# EAGLE design rPi_vsynth (EAGLE 8.5.0)
Hybrid Video Synth
DESIGNNAME: Hybrid Video Synth

## Sheet 1 of 4: Raspberry Pi
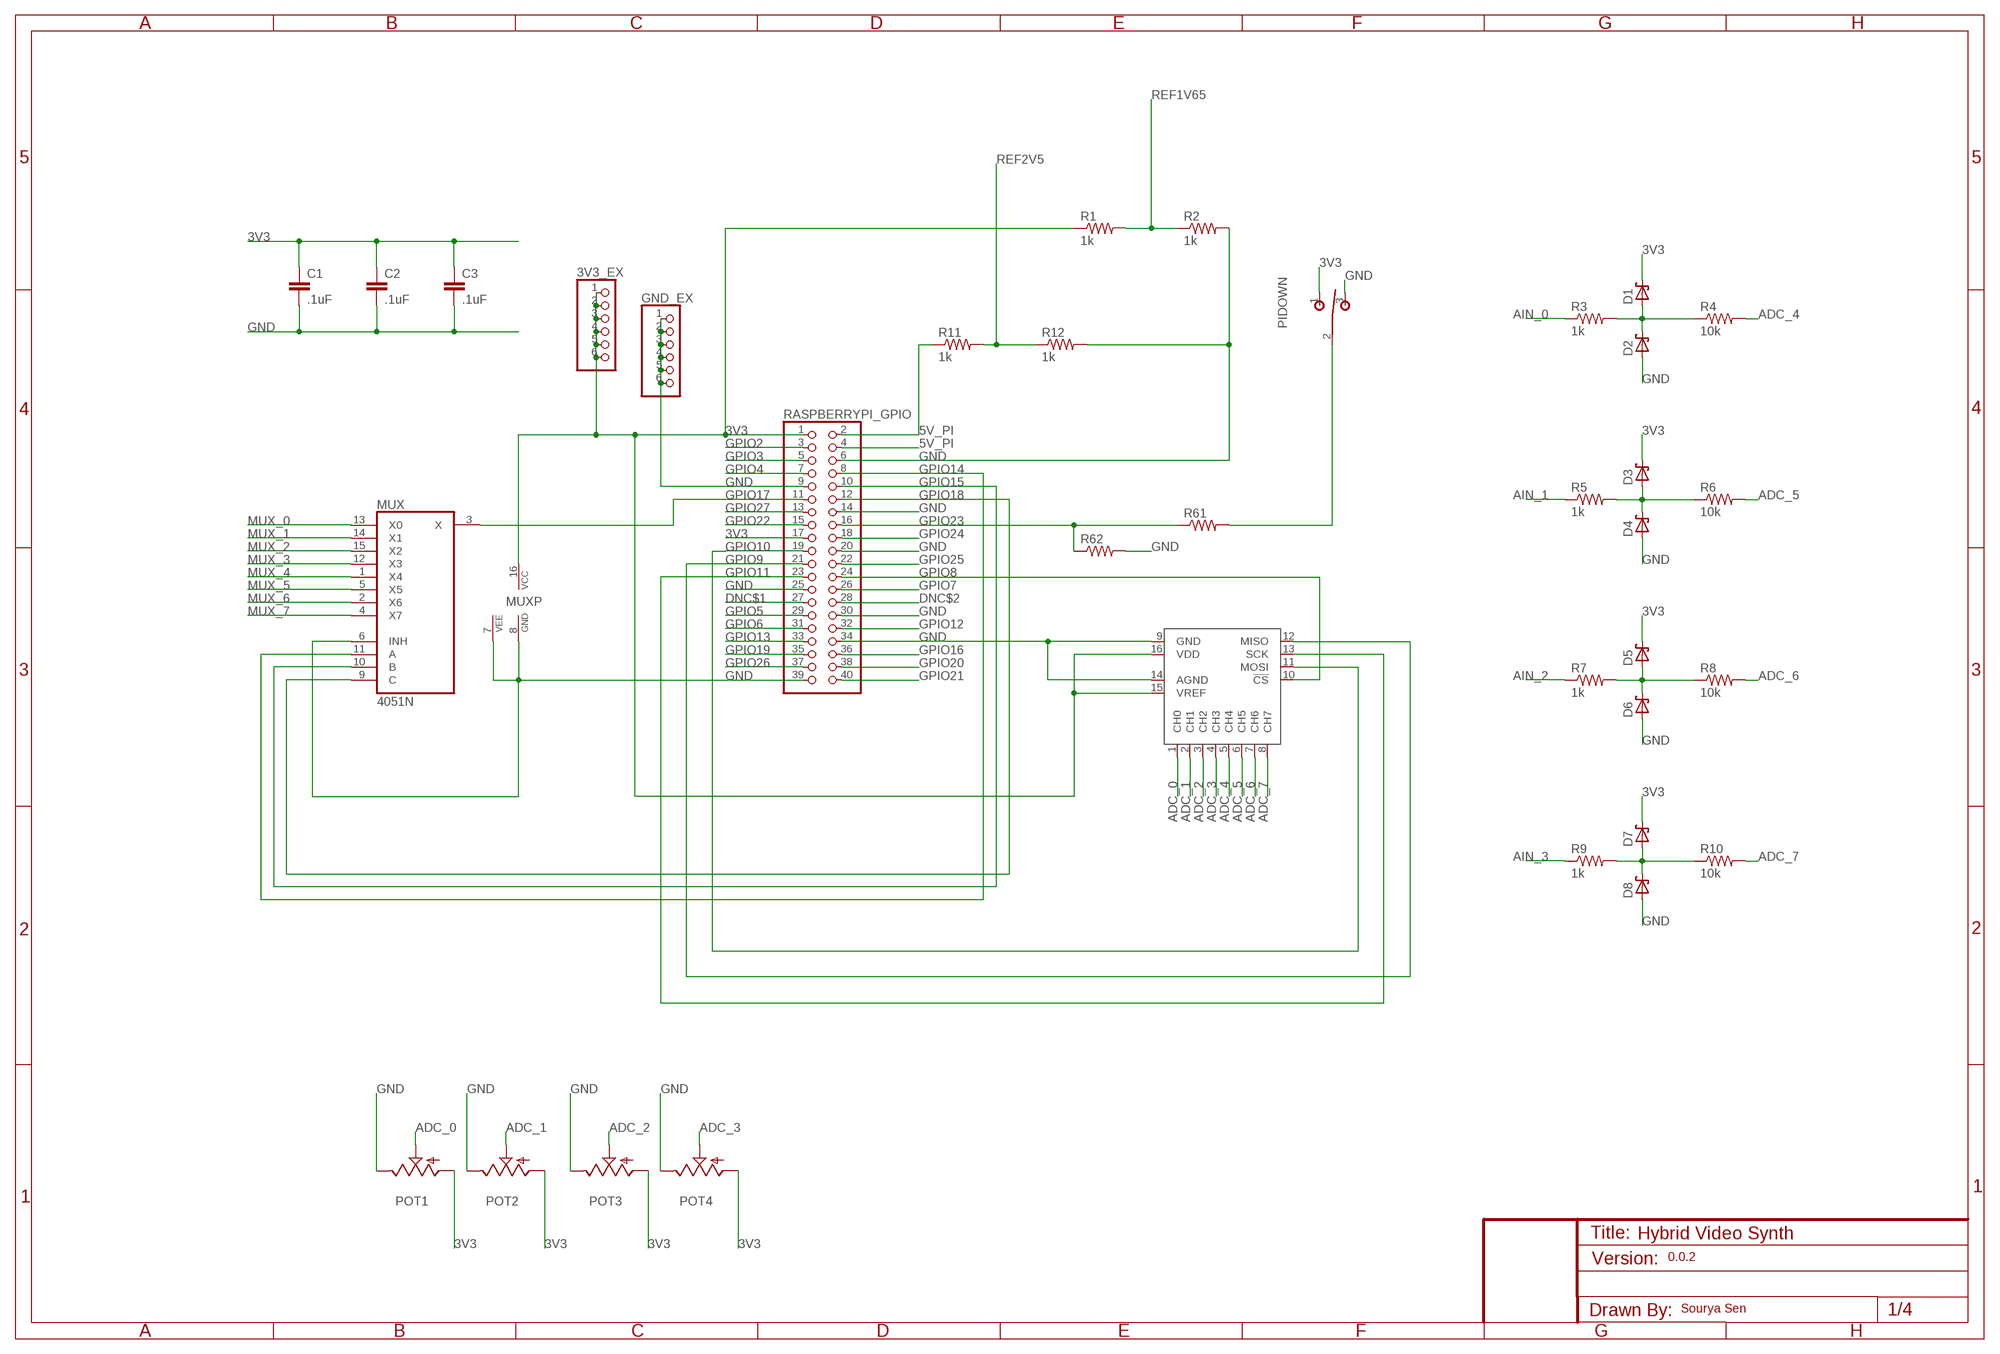
[diagram p0: schematic, sheet 1]

### Parts
3V3_EX  PINHD-1X6B  [1X06-BIG]
C1  .1uF  CAPPTH2  [CAP-PTH-SMALL2]
C2  .1uF  CAPPTH2  [CAP-PTH-SMALL2]
C3  .1uF  CAPPTH2  [CAP-PTH-SMALL2]
D1  SCHOTTKY-DIODEDO35-7  [DO35-7]
D2  SCHOTTKY-DIODEDO35-7  [DO35-7]
D3  SCHOTTKY-DIODEDO35-7  [DO35-7]
D4  SCHOTTKY-DIODEDO35-7  [DO35-7]
D5  SCHOTTKY-DIODEDO35-7  [DO35-7]
D6  SCHOTTKY-DIODEDO35-7  [DO35-7]
D7  SCHOTTKY-DIODEDO35-7  [DO35-7]
D8  SCHOTTKY-DIODEDO35-7  [DO35-7]
GND_EX  PINHD-1X6B  [1X06-BIG]
MCP3008  MCP3008P  [DIL16]
MUX  4051N  [DIL16]
PIDOWN  T-80-T-SPDT-ON-OFF-ON  [M9040P]
POT1  9MM_SNAP-IN_POT_  [9MM_SNAP-IN_POT]
POT2  9MM_SNAP-IN_POT_  [9MM_SNAP-IN_POT]
POT3  9MM_SNAP-IN_POT_  [9MM_SNAP-IN_POT]
POT4  9MM_SNAP-IN_POT_  [9MM_SNAP-IN_POT]
R1  1k  RESISTORPTH-1/4W  [AXIAL-0.4]
R2  1k  RESISTORPTH-1/4W  [AXIAL-0.4]
R3  1k  RESISTORPTH-1/4W  [AXIAL-0.4]
R4  10k  RESISTORPTH-1/4W  [AXIAL-0.4]
R5  1k  RESISTORPTH-1/4W  [AXIAL-0.4]
R6  10k  RESISTORPTH-1/4W  [AXIAL-0.4]
R7  1k  RESISTORPTH-1/4W  [AXIAL-0.4]
R8  10k  RESISTORPTH-1/4W  [AXIAL-0.4]
R9  1k  RESISTORPTH-1/4W  [AXIAL-0.4]
R10  10k  RESISTORPTH-1/4W  [AXIAL-0.4]
R11  1k  RESISTORPTH-1/4W  [AXIAL-0.4]
R12  1k  RESISTORPTH-1/4W  [AXIAL-0.4]
R61  RESISTORPTH-1/4W  [AXIAL-0.4]
R62  RESISTORPTH-1/4W  [AXIAL-0.4]
RASPBERRYPI_GPIO  PINHD-2X20  [2X20]

### Nets
3V3 [POWER]: 3V3_EX.1 3V3_EX.2 3V3_EX.3 3V3_EX.4 3V3_EX.5 3V3_EX.6 C1.1 C2.1 C3.1 D1.C D3.C D5.C D7.C MCP3008.15(VREF) MCP3008.16(VDD) MUX.16(VCC) PIDOWN.1(O) POT1.1(A) POT2.1(A) POT3.1(A) POT4.1(A) R1.P$1 RASPBERRYPI_GPIO.1 RASPBERRYPI_GPIO.17 ; also sheet 3
5V_PI [POWER]: R11.P$1 RASPBERRYPI_GPIO.2 RASPBERRYPI_GPIO.4 ; also sheet 2
ADC_0: MCP3008.1(CH0) POT1.2(S)
ADC_1: MCP3008.2(CH1) POT2.2(S)
ADC_2: MCP3008.3(CH2) POT3.2(S)
ADC_3: MCP3008.4(CH3) POT4.2(S)
ADC_4: MCP3008.5(CH4) R4.P$2
ADC_5: MCP3008.6(CH5) R6.P$2
ADC_6: MCP3008.7(CH6) R8.P$2
ADC_7: MCP3008.8(CH7) R10.P$2
AIN_0: R3.P$1 ; also sheet 2
AIN_1: R5.P$1 ; also sheet 2
AIN_2: R7.P$1 ; also sheet 2
AIN_3: R9.P$1 ; also sheet 2
DNC$1: RASPBERRYPI_GPIO.27
DNC$2: RASPBERRYPI_GPIO.28
GND [GND]: C1.2 C2.2 C3.2 D2.A D4.A D6.A D8.A GND_EX.1 GND_EX.2 GND_EX.3 GND_EX.4 GND_EX.5 GND_EX.6 MCP3008.9(GND) MCP3008.14(AGND) MUX.6(INH) MUX.7(VEE) MUX.8(GND) PIDOWN.3(S) POT1.3(E) POT2.3(E) POT3.3(E) POT4.3(E) R2.P$2 R12.P$2 R62.P$2 RASPBERRYPI_GPIO.6 RASPBERRYPI_GPIO.9 RASPBERRYPI_GPIO.14 RASPBERRYPI_GPIO.20 RASPBERRYPI_GPIO.25 RASPBERRYPI_GPIO.30 RASPBERRYPI_GPIO.34 RASPBERRYPI_GPIO.39 ; also sheet 2,3,4
GPIO2: RASPBERRYPI_GPIO.3
GPIO3: RASPBERRYPI_GPIO.5
GPIO4: RASPBERRYPI_GPIO.7
GPIO5: RASPBERRYPI_GPIO.29
GPIO6: RASPBERRYPI_GPIO.31
GPIO7: RASPBERRYPI_GPIO.26
GPIO8: MCP3008.10(!CS) RASPBERRYPI_GPIO.24
GPIO9: MCP3008.12(MISO) RASPBERRYPI_GPIO.21
GPIO10: MCP3008.11(MOSI) RASPBERRYPI_GPIO.19
GPIO11: MCP3008.13(SCK) RASPBERRYPI_GPIO.23
GPIO12: RASPBERRYPI_GPIO.32
GPIO13: RASPBERRYPI_GPIO.33
GPIO14: MUX.11(A) RASPBERRYPI_GPIO.8
GPIO15: MUX.10(B) RASPBERRYPI_GPIO.10
GPIO16: RASPBERRYPI_GPIO.36
GPIO17: MUX.3(X) RASPBERRYPI_GPIO.11
GPIO18: MUX.9(C) RASPBERRYPI_GPIO.12
GPIO19: RASPBERRYPI_GPIO.35
GPIO20: RASPBERRYPI_GPIO.38
GPIO21: RASPBERRYPI_GPIO.40
GPIO22: RASPBERRYPI_GPIO.15
GPIO23: R61.P$1 R62.P$1 RASPBERRYPI_GPIO.16
GPIO24: RASPBERRYPI_GPIO.18
GPIO25: RASPBERRYPI_GPIO.22
GPIO26: RASPBERRYPI_GPIO.37
GPIO27: RASPBERRYPI_GPIO.13
MUX_0: MUX.13(X0) ; also sheet 3,4
MUX_1: MUX.14(X1) ; also sheet 3,4
MUX_2: MUX.15(X2) ; also sheet 3,4
MUX_3: MUX.12(X3) ; also sheet 3,4
MUX_4: MUX.1(X4) ; also sheet 3,4
MUX_5: MUX.5(X5) ; also sheet 3,4
MUX_6: MUX.2(X6) ; also sheet 3,4
MUX_7: MUX.4(X7) ; also sheet 3,4
N$1: D1.A D2.C R3.P$2 R4.P$1
N$2: D3.A D4.C R5.P$2 R6.P$1
N$3: D5.A D6.C R7.P$2 R8.P$1
N$4: D7.A D8.C R9.P$2 R10.P$1
N$63: PIDOWN.2(P) R61.P$2
REF1V65 [POWER]: R1.P$2 R2.P$1 ; also sheet 2
REF2V5 [POWER]: R11.P$2 R12.P$1 ; also sheet 2

## Sheet 2 of 4: Opamps and Euro Power
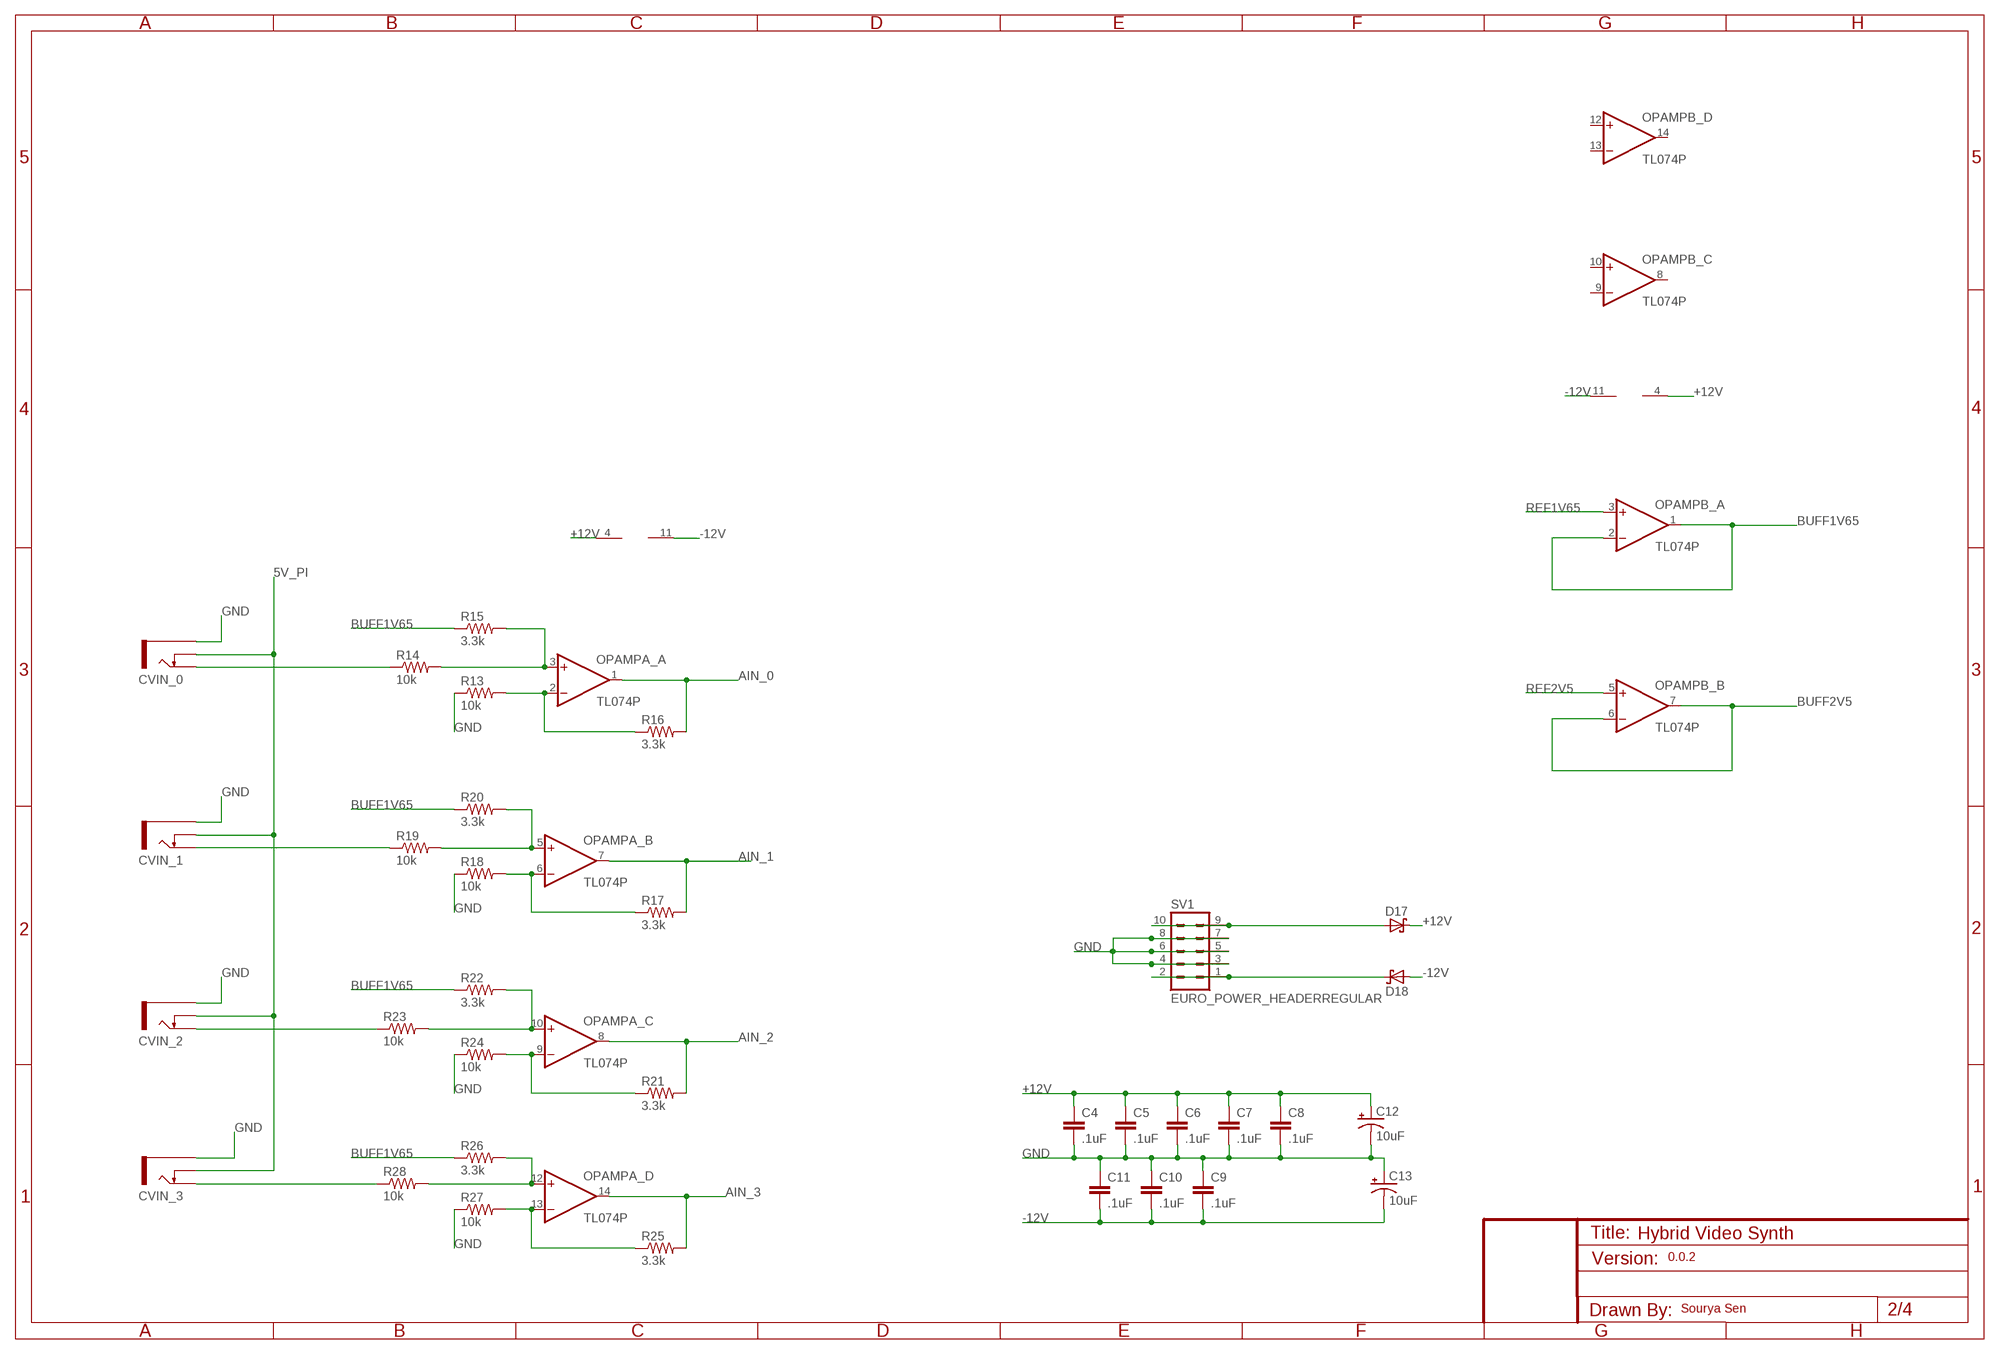
[diagram p1: schematic, sheet 2]

### Parts
C4  .1uF  CAPPTH2  [CAP-PTH-SMALL2]
C5  .1uF  CAPPTH2  [CAP-PTH-SMALL2]
C6  .1uF  CAPPTH2  [CAP-PTH-SMALL2]
C7  .1uF  CAPPTH2  [CAP-PTH-SMALL2]
C8  .1uF  CAPPTH2  [CAP-PTH-SMALL2]
C9  .1uF  CAPPTH2  [CAP-PTH-SMALL2]
C10  .1uF  CAPPTH2  [CAP-PTH-SMALL2]
C11  .1uF  CAPPTH2  [CAP-PTH-SMALL2]
C12  10uF  CAP_POLPTH2  [CPOL-RADIAL-10UF-25V]
C13  10uF  CAP_POLPTH2  [CPOL-RADIAL-10UF-25V]
CVIN_0  THONKICONNOLD  [THONKICONN]
CVIN_1  THONKICONNOLD  [THONKICONN]
CVIN_2  THONKICONNOLD  [THONKICONN]
CVIN_3  THONKICONNOLD  [THONKICONN]
D17  SCHOTTKY-DIODEDO35-7  [DO35-7]
D18  SCHOTTKY-DIODEDO35-7  [DO35-7]
OPAMPA_  TL074P  [DIL14]
OPAMPB_  TL074P  [DIL14]
R13  10k  RESISTORPTH-1/4W  [AXIAL-0.4]
R14  10k  RESISTORPTH-1/4W  [AXIAL-0.4]
R15  3.3k  RESISTORPTH-1/4W  [AXIAL-0.4]
R16  3.3k  RESISTORPTH-1/4W  [AXIAL-0.4]
R17  3.3k  RESISTORPTH-1/4W  [AXIAL-0.4]
R18  10k  RESISTORPTH-1/4W  [AXIAL-0.4]
R19  10k  RESISTORPTH-1/4W  [AXIAL-0.4]
R20  3.3k  RESISTORPTH-1/4W  [AXIAL-0.4]
R21  3.3k  RESISTORPTH-1/4W  [AXIAL-0.4]
R22  3.3k  RESISTORPTH-1/4W  [AXIAL-0.4]
R23  10k  RESISTORPTH-1/4W  [AXIAL-0.4]
R24  10k  RESISTORPTH-1/4W  [AXIAL-0.4]
R25  3.3k  RESISTORPTH-1/4W  [AXIAL-0.4]
R26  3.3k  RESISTORPTH-1/4W  [AXIAL-0.4]
R27  10k  RESISTORPTH-1/4W  [AXIAL-0.4]
R28  10k  RESISTORPTH-1/4W  [AXIAL-0.4]
SV1  EURO_POWER_HEADERREGULAR  [EURO_POWER_HEADER]

### Nets
5V_PI [POWER]: CVIN_0.P$2_SWITCH(SWITCH) CVIN_1.P$2_SWITCH(SWITCH) CVIN_2.P$2_SWITCH(SWITCH) CVIN_3.P$2_SWITCH(SWITCH) ; also sheet 1
+12V [POWER]: C4.1 C5.1 C6.1 C7.1 C8.1 C12.1(+) D17.C OPAMPA_.4(P:V+) OPAMPB_.4(P:V+) ; also sheet 3,4
-12V [POWER]: C9.2 C10.2 C11.2 C13.2(-) D18.A OPAMPA_.11(P:V-) OPAMPB_.11(P:V-)
AIN_0: OPAMPA_.1(A:OUT) R16.P$2 ; also sheet 1
AIN_1: OPAMPA_.7(B:OUT) R17.P$2 ; also sheet 1
AIN_2: OPAMPA_.8(C:OUT) R21.P$2 ; also sheet 1
AIN_3: OPAMPA_.14(D:OUT) R25.P$2 ; also sheet 1
BUFF1V65: OPAMPB_.1(A:OUT) OPAMPB_.2(A:-IN) R15.P$1 R20.P$1 R22.P$1 R26.P$1
BUFF2V5 [POWER]: OPAMPB_.6(B:-IN) OPAMPB_.7(B:OUT) ; also sheet 3
GND [GND]: C4.2 C5.2 C6.2 C7.2 C8.2 C9.1 C10.1 C11.1 C12.2(-) C13.1(+) CVIN_0.P$1_SLEEVE(SLEEVE) CVIN_1.P$1_SLEEVE(SLEEVE) CVIN_2.P$1_SLEEVE(SLEEVE) CVIN_3.P$1_SLEEVE(SLEEVE) R13.P$1 R18.P$1 R24.P$1 R27.P$1 SV1.3 SV1.4 SV1.5 SV1.6 SV1.7 SV1.8 ; also sheet 1,3,4
N$5: OPAMPA_.2(A:-IN) R13.P$2 R16.P$1
N$6: CVIN_0.P$3_TIP(TIP) R14.P$1
N$7: OPAMPA_.6(B:-IN) R17.P$1 R18.P$2
N$8: OPAMPA_.3(A:+IN) R14.P$2 R15.P$2
N$9: OPAMPA_.9(C:-IN) R21.P$1 R24.P$2
N$10: OPAMPA_.5(B:+IN) R19.P$2 R20.P$2
N$11: OPAMPA_.10(C:+IN) R22.P$2 R23.P$2
N$12: CVIN_1.P$3_TIP(TIP) R19.P$1
N$13: OPAMPA_.13(D:-IN) R25.P$1 R27.P$2
N$14: CVIN_2.P$3_TIP(TIP) R23.P$1
N$15: CVIN_3.P$3_TIP(TIP) R28.P$1
N$16: OPAMPA_.12(D:+IN) R26.P$2 R28.P$2
N$66 [POWER]: D17.A SV1.9 SV1.10
N$68 [POWER]: D18.C SV1.1 SV1.2
REF1V65 [POWER]: OPAMPB_.3(A:+IN) ; also sheet 1
REF2V5 [POWER]: OPAMPB_.5(B:+IN) ; also sheet 1
Unconnected: OPAMPB_.8(C:OUT) OPAMPB_.9(C:-IN) OPAMPB_.10(C:+IN) OPAMPB_.12(D:+IN) OPAMPB_.13(D:-IN) OPAMPB_.14(D:OUT)

## Sheet 3 of 4: Trigger Comparators
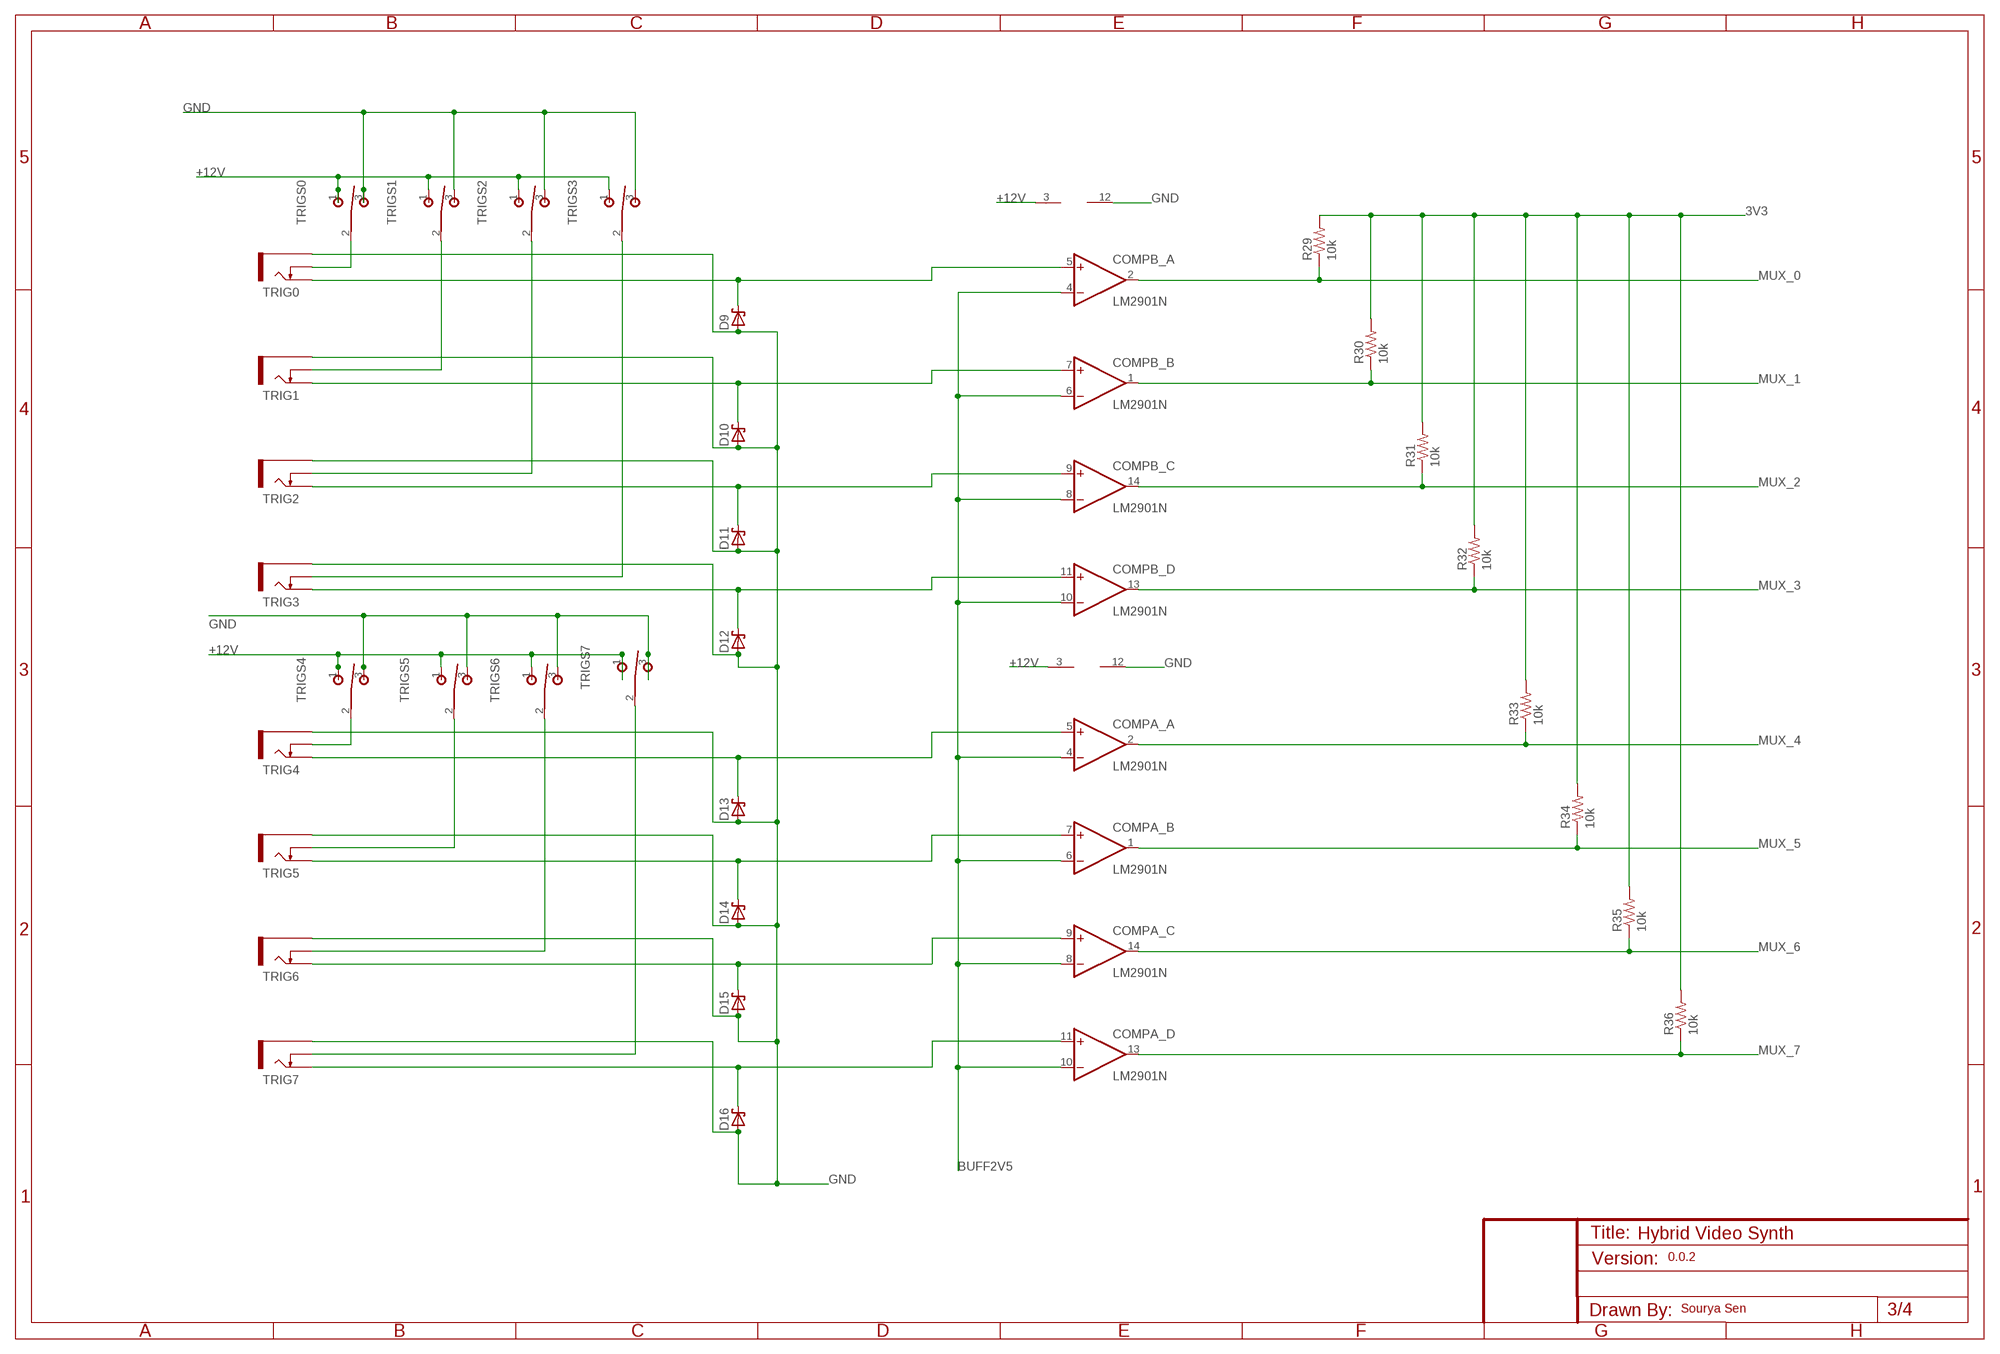
[diagram p2: schematic, sheet 3]

### Parts
COMPA_  LM2901N  [DIL14]
COMPB_  LM2901N  [DIL14]
D9  SCHOTTKY-DIODEDO35-7  [DO35-7]
D10  SCHOTTKY-DIODEDO35-7  [DO35-7]
D11  SCHOTTKY-DIODEDO35-7  [DO35-7]
D12  SCHOTTKY-DIODEDO35-7  [DO35-7]
D13  SCHOTTKY-DIODEDO35-7  [DO35-7]
D14  SCHOTTKY-DIODEDO35-7  [DO35-7]
D15  SCHOTTKY-DIODEDO35-7  [DO35-7]
D16  SCHOTTKY-DIODEDO35-7  [DO35-7]
R29  10k  RESISTORPTH-1/4W  [AXIAL-0.4]
R30  10k  RESISTORPTH-1/4W  [AXIAL-0.4]
R31  10k  RESISTORPTH-1/4W  [AXIAL-0.4]
R32  10k  RESISTORPTH-1/4W  [AXIAL-0.4]
R33  10k  RESISTORPTH-1/4W  [AXIAL-0.4]
R34  10k  RESISTORPTH-1/4W  [AXIAL-0.4]
R35  10k  RESISTORPTH-1/4W  [AXIAL-0.4]
R36  10k  RESISTORPTH-1/4W  [AXIAL-0.4]
TRIG0  THONKICONNOLD  [THONKICONN]
TRIG1  THONKICONNOLD  [THONKICONN]
TRIG2  THONKICONNOLD  [THONKICONN]
TRIG3  THONKICONNOLD  [THONKICONN]
TRIG4  THONKICONNOLD  [THONKICONN]
TRIG5  THONKICONNOLD  [THONKICONN]
TRIG6  THONKICONNOLD  [THONKICONN]
TRIG7  THONKICONNOLD  [THONKICONN]
TRIGS0  T-80-T-SPDT-ON-OFF-ON  [M9040P]
TRIGS1  T-80-T-SPDT-ON-OFF-ON  [M9040P]
TRIGS2  T-80-T-SPDT-ON-OFF-ON  [M9040P]
TRIGS3  T-80-T-SPDT-ON-OFF-ON  [M9040P]
TRIGS4  T-80-T-SPDT-ON-OFF-ON  [M9040P]
TRIGS5  T-80-T-SPDT-ON-OFF-ON  [M9040P]
TRIGS6  T-80-T-SPDT-ON-OFF-ON  [M9040P]
TRIGS7  T-80-T-SPDT-ON-OFF-ON  [M9040P]

### Nets
3V3 [POWER]: R29.P$2 R30.P$2 R31.P$2 R32.P$2 R33.P$2 R34.P$2 R35.P$2 R36.P$2 ; also sheet 1
+12V [POWER]: COMPA_.3(P:V+) COMPB_.3(P:V+) TRIGS0.1(O) TRIGS1.1(O) TRIGS2.1(O) TRIGS3.1(O) TRIGS4.1(O) TRIGS5.1(O) TRIGS6.1(O) TRIGS7.1(O) ; also sheet 2,4
BUFF2V5 [POWER]: COMPA_.4(A:-IN) COMPA_.6(B:-IN) COMPA_.8(C:-IN) COMPA_.10(D:-IN) COMPB_.4(A:-IN) COMPB_.6(B:-IN) COMPB_.8(C:-IN) COMPB_.10(D:-IN) ; also sheet 2
GND [GND]: COMPA_.12(P:V-) COMPB_.12(P:V-) D9.A D10.A D11.A D12.A D13.A D14.A D15.A D16.A TRIG0.P$1_SLEEVE(SLEEVE) TRIG1.P$1_SLEEVE(SLEEVE) TRIG2.P$1_SLEEVE(SLEEVE) TRIG3.P$1_SLEEVE(SLEEVE) TRIG4.P$1_SLEEVE(SLEEVE) TRIG5.P$1_SLEEVE(SLEEVE) TRIG6.P$1_SLEEVE(SLEEVE) TRIG7.P$1_SLEEVE(SLEEVE) TRIGS0.3(S) TRIGS1.3(S) TRIGS2.3(S) TRIGS3.3(S) TRIGS4.3(S) TRIGS5.3(S) TRIGS6.3(S) TRIGS7.3(S) ; also sheet 1,2,4
MUX_0: COMPB_.2(A:OUT) R29.P$1 ; also sheet 1,4
MUX_1: COMPB_.1(B:OUT) R30.P$1 ; also sheet 1,4
MUX_2: COMPB_.14(C:OUT) R31.P$1 ; also sheet 1,4
MUX_3: COMPB_.13(D:OUT) R32.P$1 ; also sheet 1,4
MUX_4: COMPA_.2(A:OUT) R33.P$1 ; also sheet 1,4
MUX_5: COMPA_.1(B:OUT) R34.P$1 ; also sheet 1,4
MUX_6: COMPA_.14(C:OUT) R35.P$1 ; also sheet 1,4
MUX_7: COMPA_.13(D:OUT) R36.P$1 ; also sheet 1,4
N$17: TRIG0.P$2_SWITCH(SWITCH) TRIGS0.2(P)
N$18: TRIG1.P$2_SWITCH(SWITCH) TRIGS1.2(P)
N$19: TRIG2.P$2_SWITCH(SWITCH) TRIGS2.2(P)
N$20: TRIG3.P$2_SWITCH(SWITCH) TRIGS3.2(P)
N$25: TRIG4.P$2_SWITCH(SWITCH) TRIGS4.2(P)
N$26: TRIG5.P$2_SWITCH(SWITCH) TRIGS5.2(P)
N$27: TRIG6.P$2_SWITCH(SWITCH) TRIGS6.2(P)
N$28: TRIG7.P$2_SWITCH(SWITCH) TRIGS7.2(P)
N$50: COMPB_.5(A:+IN) D9.C TRIG0.P$3_TIP(TIP)
N$53: COMPB_.7(B:+IN) D10.C TRIG1.P$3_TIP(TIP)
N$54: COMPB_.9(C:+IN) D11.C TRIG2.P$3_TIP(TIP)
N$56: COMPB_.11(D:+IN) D12.C TRIG3.P$3_TIP(TIP)
N$57: COMPA_.5(A:+IN) D13.C TRIG4.P$3_TIP(TIP)
N$59: COMPA_.7(B:+IN) D14.C TRIG5.P$3_TIP(TIP)
N$60: COMPA_.9(C:+IN) D15.C TRIG6.P$3_TIP(TIP)
N$62: COMPA_.11(D:+IN) D16.C TRIG7.P$3_TIP(TIP)

## Sheet 4 of 4: LED Driver
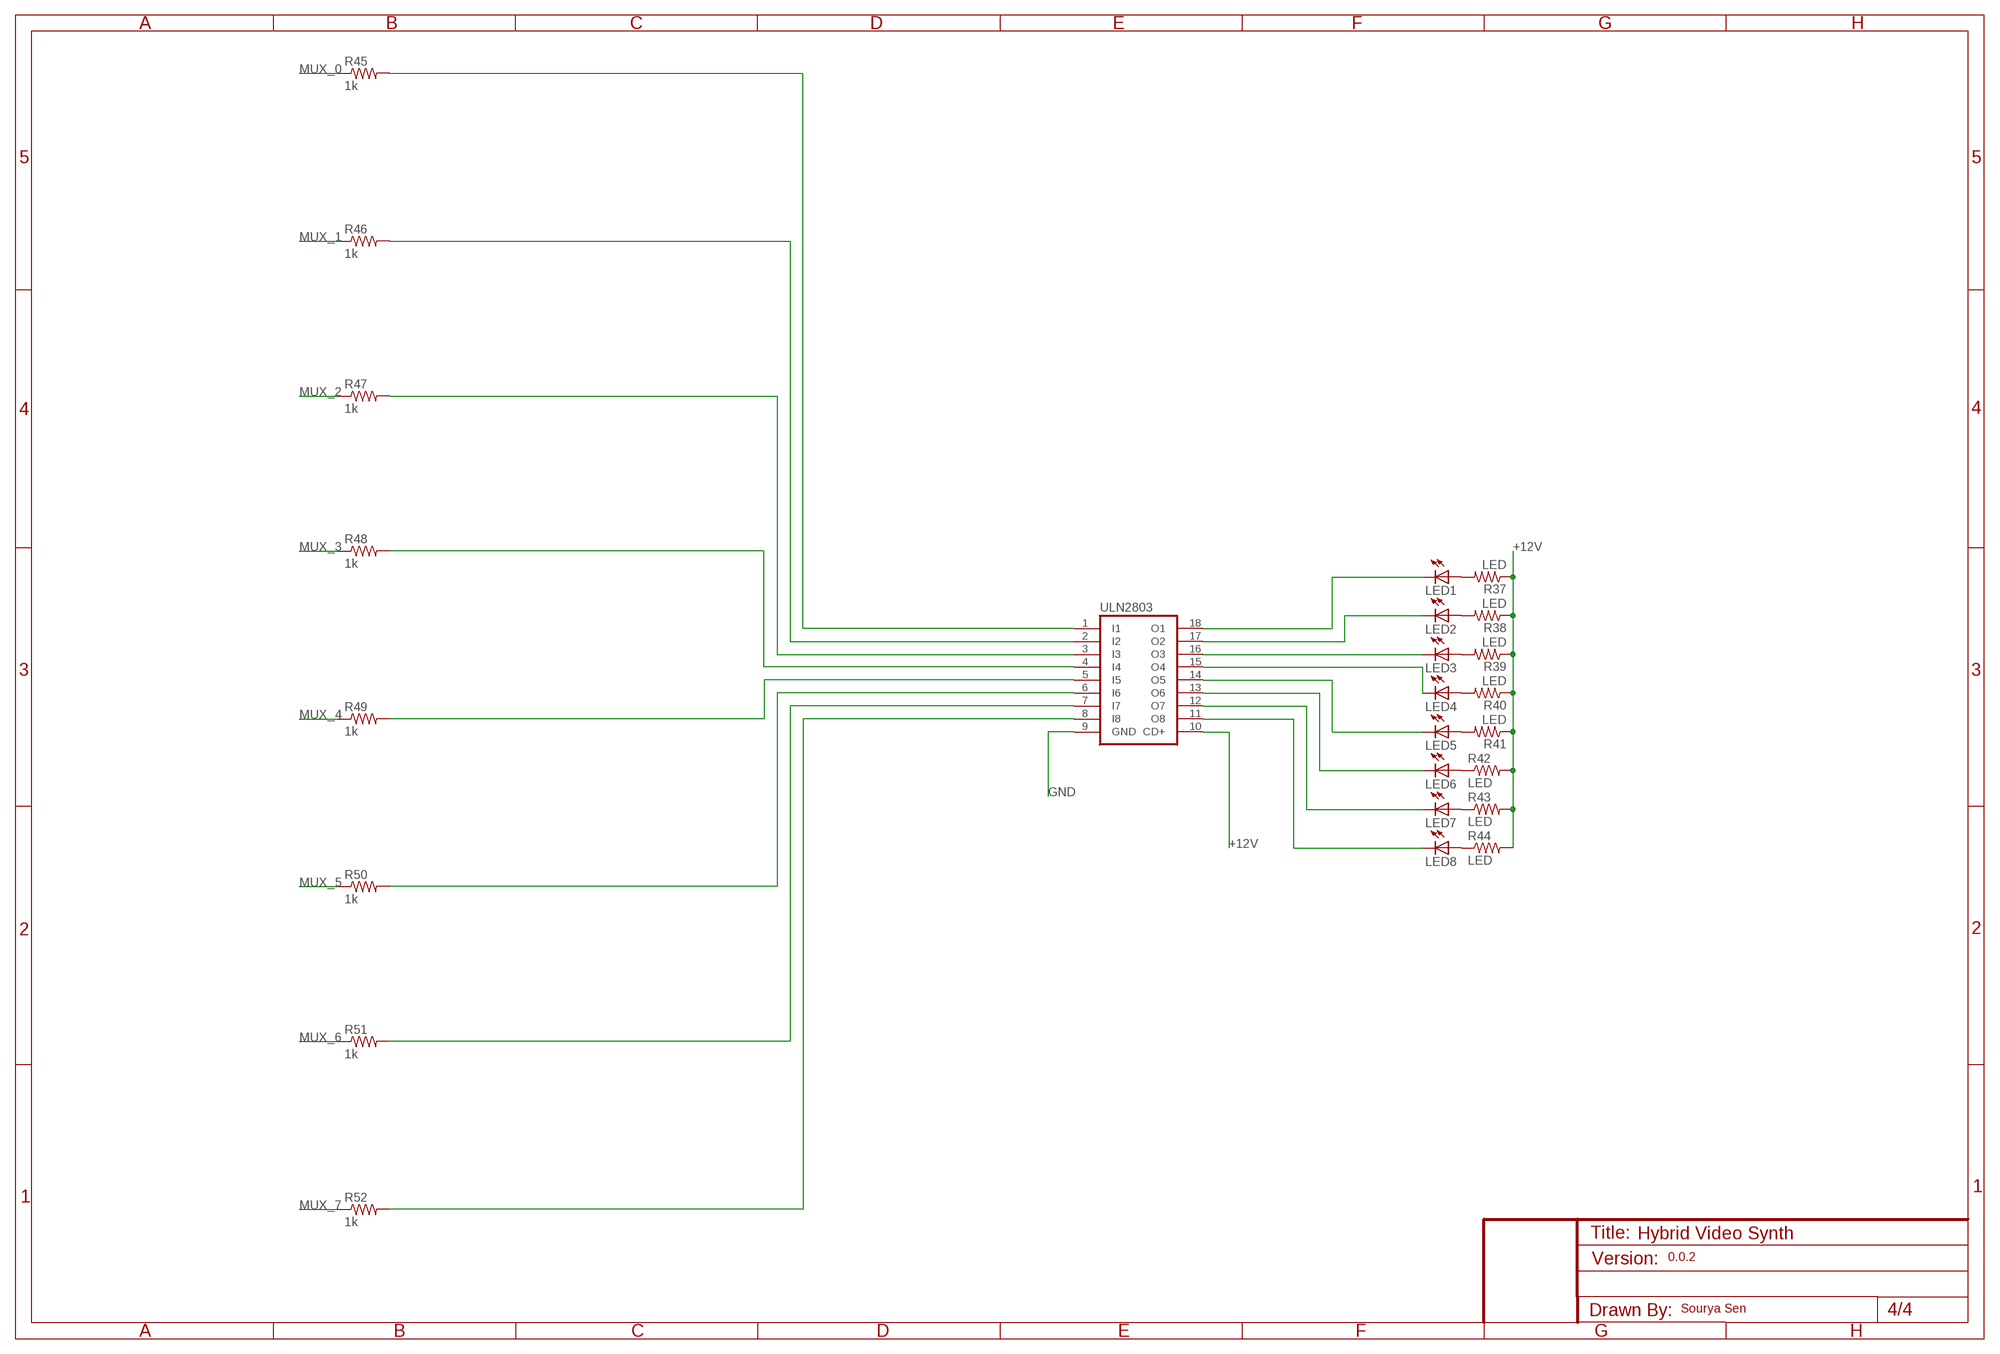
[diagram p3: schematic, sheet 4]

### Parts
LED1  LED3MM  [LED3MM]
LED2  LED3MM  [LED3MM]
LED3  LED3MM  [LED3MM]
LED4  LED3MM  [LED3MM]
LED5  LED3MM  [LED3MM]
LED6  LED3MM  [LED3MM]
LED7  LED3MM  [LED3MM]
LED8  LED3MM  [LED3MM]
R37  LED  RESISTORPTH-1/4W  [AXIAL-0.4]
R38  LED  RESISTORPTH-1/4W  [AXIAL-0.4]
R39  LED  RESISTORPTH-1/4W  [AXIAL-0.4]
R40  LED  RESISTORPTH-1/4W  [AXIAL-0.4]
R41  LED  RESISTORPTH-1/4W  [AXIAL-0.4]
R42  LED  RESISTORPTH-1/4W  [AXIAL-0.4]
R43  LED  RESISTORPTH-1/4W  [AXIAL-0.4]
R44  LED  RESISTORPTH-1/4W  [AXIAL-0.4]
R45  1k  RESISTORPTH-1/4W  [AXIAL-0.4]
R46  1k  RESISTORPTH-1/4W  [AXIAL-0.4]
R47  1k  RESISTORPTH-1/4W  [AXIAL-0.4]
R48  1k  RESISTORPTH-1/4W  [AXIAL-0.4]
R49  1k  RESISTORPTH-1/4W  [AXIAL-0.4]
R50  1k  RESISTORPTH-1/4W  [AXIAL-0.4]
R51  1k  RESISTORPTH-1/4W  [AXIAL-0.4]
R52  1k  RESISTORPTH-1/4W  [AXIAL-0.4]
ULN2803  ULN2803A  [DIL18]

### Nets
+12V [POWER]: R37.P$1 R38.P$1 R39.P$1 R40.P$1 R41.P$1 R42.P$2 R43.P$2 R44.P$2 ULN2803.10(CD+) ; also sheet 2,3
GND [GND]: ULN2803.9(GND) ; also sheet 1,2,3
MUX_0: R45.P$1 ; also sheet 1,3
MUX_1: R46.P$1 ; also sheet 1,3
MUX_2: R47.P$1 ; also sheet 1,3
MUX_3: R48.P$1 ; also sheet 1,3
MUX_4: R49.P$1 ; also sheet 1,3
MUX_5: R50.P$1 ; also sheet 1,3
MUX_6: R51.P$1 ; also sheet 1,3
MUX_7: R52.P$1 ; also sheet 1,3
N$21: LED1.A R37.P$2
N$22: LED2.A R38.P$2
N$23: LED3.A R39.P$2
N$24: LED4.A R40.P$2
N$29: LED5.A R41.P$2
N$30: LED6.A R42.P$1
N$31: LED7.A R43.P$1
N$32: LED8.A R44.P$1
N$33: LED3.K(C) ULN2803.16(O3)
N$41: R45.P$2 ULN2803.1(I1)
N$42: LED1.K(C) ULN2803.18(O1)
N$43: LED2.K(C) ULN2803.17(O2)
N$45: LED4.K(C) ULN2803.15(O4)
N$46: LED5.K(C) ULN2803.14(O5)
N$47: LED6.K(C) ULN2803.13(O6)
N$48: LED7.K(C) ULN2803.12(O7)
N$49: LED8.K(C) ULN2803.11(O8)
N$51: R52.P$2 ULN2803.8(I8)
N$52: R46.P$2 ULN2803.2(I2)
N$55: R47.P$2 ULN2803.3(I3)
N$58: R48.P$2 ULN2803.4(I4)
N$61: R49.P$2 ULN2803.5(I5)
N$64: R50.P$2 ULN2803.6(I6)
N$67: R51.P$2 ULN2803.7(I7)

## Library data of the parts
3V3_EX GND_EX = adafruit:PINHD-1X6: PIN HEADER
C1-C11 = SparkFun:CAP: Capacitor Standard 0603 ceramic capacitor, and 0.1" leaded capacitor.
C12 C13 = SparkFun:CAP_POL: Capacitor Polarized These are standard SMD and PTH capacitors. Normally 10uF, 47uF, and 100uF in electrolytic and tantalum varieties. Always verify the external diameter of the through hole cap, it varies with capacity, voltage, and manufacturer. The EIA devices should be standard.
COMPA_ COMPB_ = linear:LM2901: COMPARATOR
CVIN_0 CVIN_1-CVIN_3 TRIG0 TRIG1-TRIG7 = MusicThingModular:THONKICONN: 3.5mm socket for Eurorack modular synths
D1-D18 = adafruit:SCHOTTKY-DIODE: Schottky Diode
LED1-LED8 = SparkFun:LED: LEDs Standard schematic elements and footprints for 5mm, 3mm, 1206, and 0603 sized LEDs. 5mm - Spark Fun Electronics SKU : COM-00529 (and others)
MCP3008 = MCP3008:MCP3008
MUX = 40xx:4051: 8-channel ANALOG MULTIPLEXER
OPAMPA_ OPAMPB_ = linear:TL074: OP AMP
PIDOWN TRIGS0 TRIGS1-TRIGS7 = MusicThingModular:T-80-T-SPDT-ON-OFF-ON
POT1-POT4 = MusicThingModular:9MM_SNAP-IN_POT: 9mm vertical snap-in pot, Alpha / Panasonic style
R1-R52 R61 R62 = SparkFun:RESISTOR: Resistor Basic schematic elements and footprints for 0603, 1206, and PTH resistors.
RASPBERRYPI_GPIO = adafruit:PINHD-2X20: PIN HEADER
SV1 = MusicThingModular:EURO_POWER_HEADER: Power Header 10 pin power header for Eurorack Power Supplies Variants with fatter pads for easier soldering, and the LOCK variant which has 5mil offset pins to hold the component in place before soldering
ULN2803 = uln-udn:ULN2803A: DRIVER ARRAY

## Net classes
1 POWER: width 0.61 mm
2 GND: width 0.305 mm

## Board
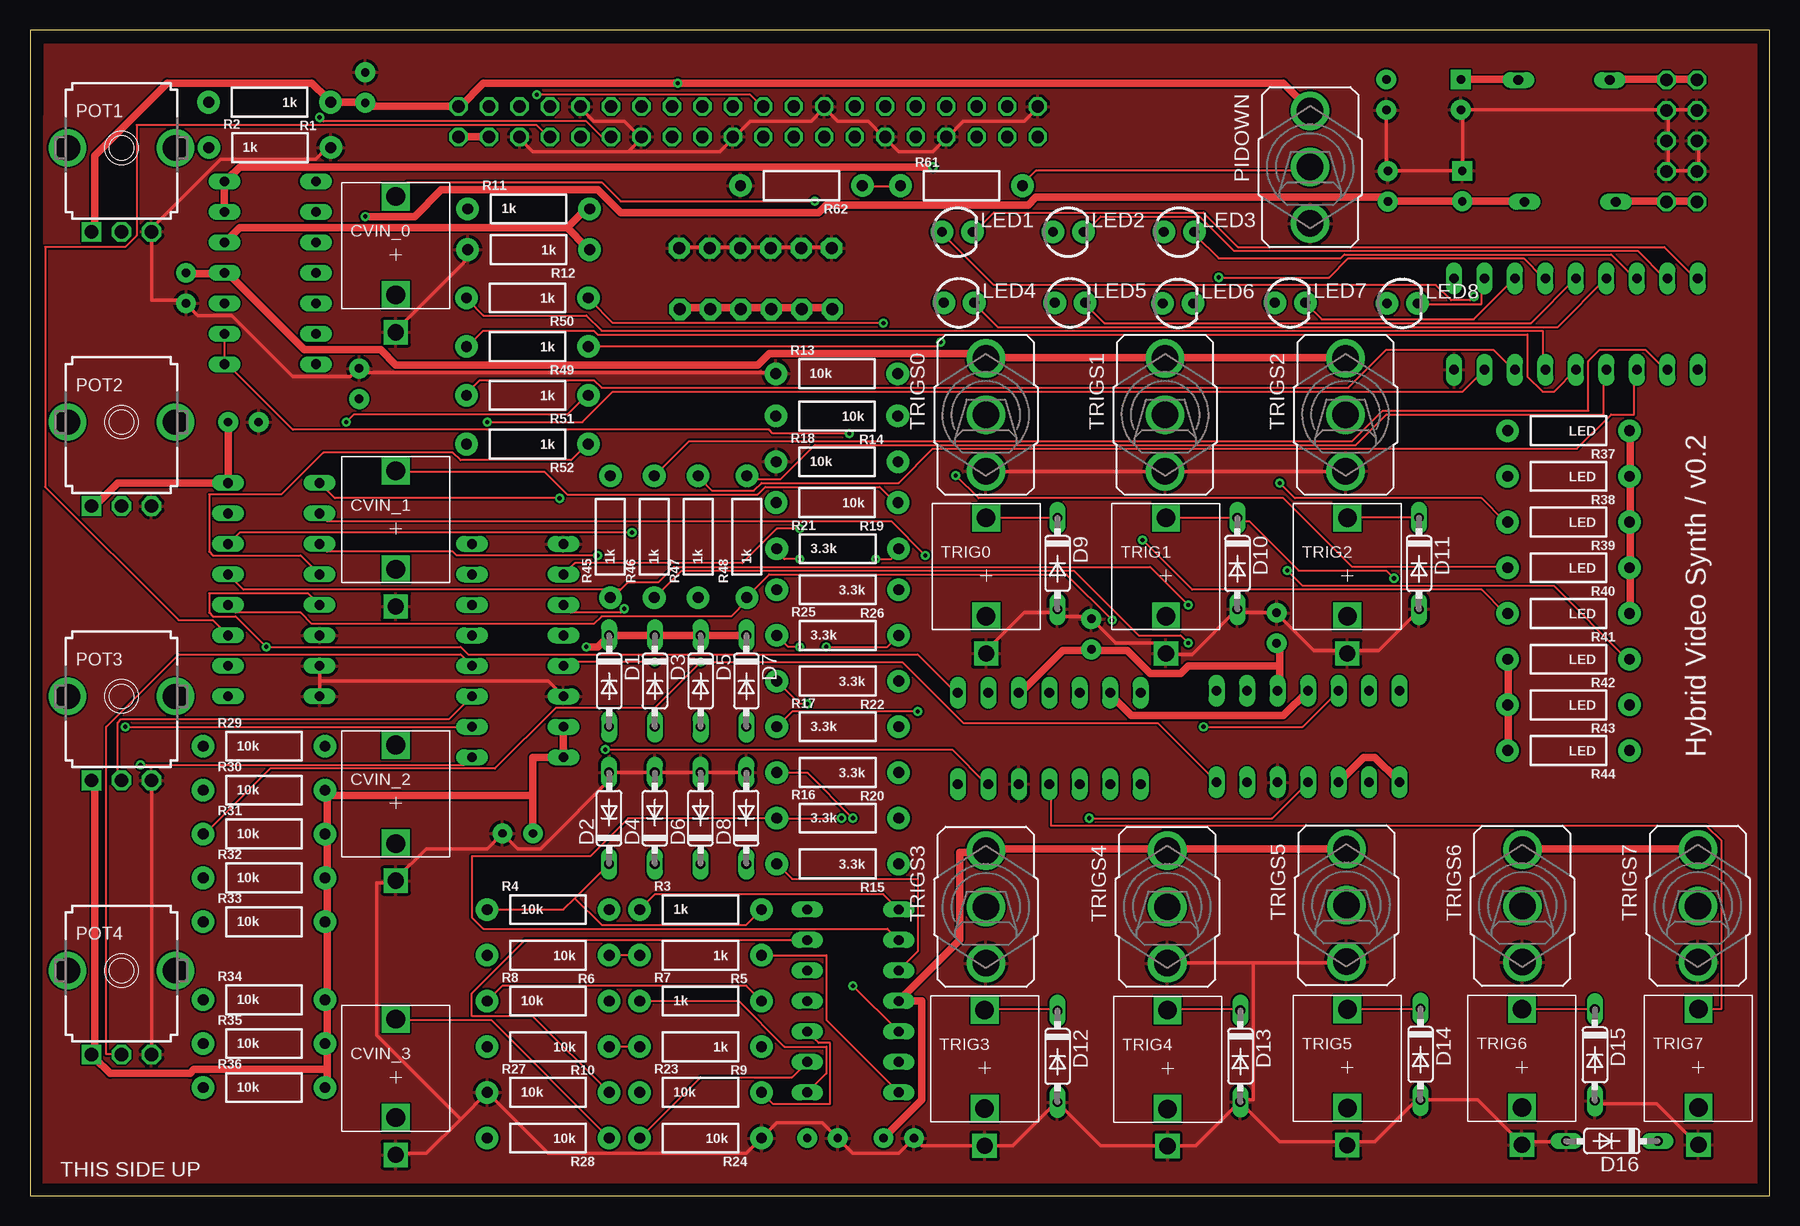
[diagram p4: board, top side]
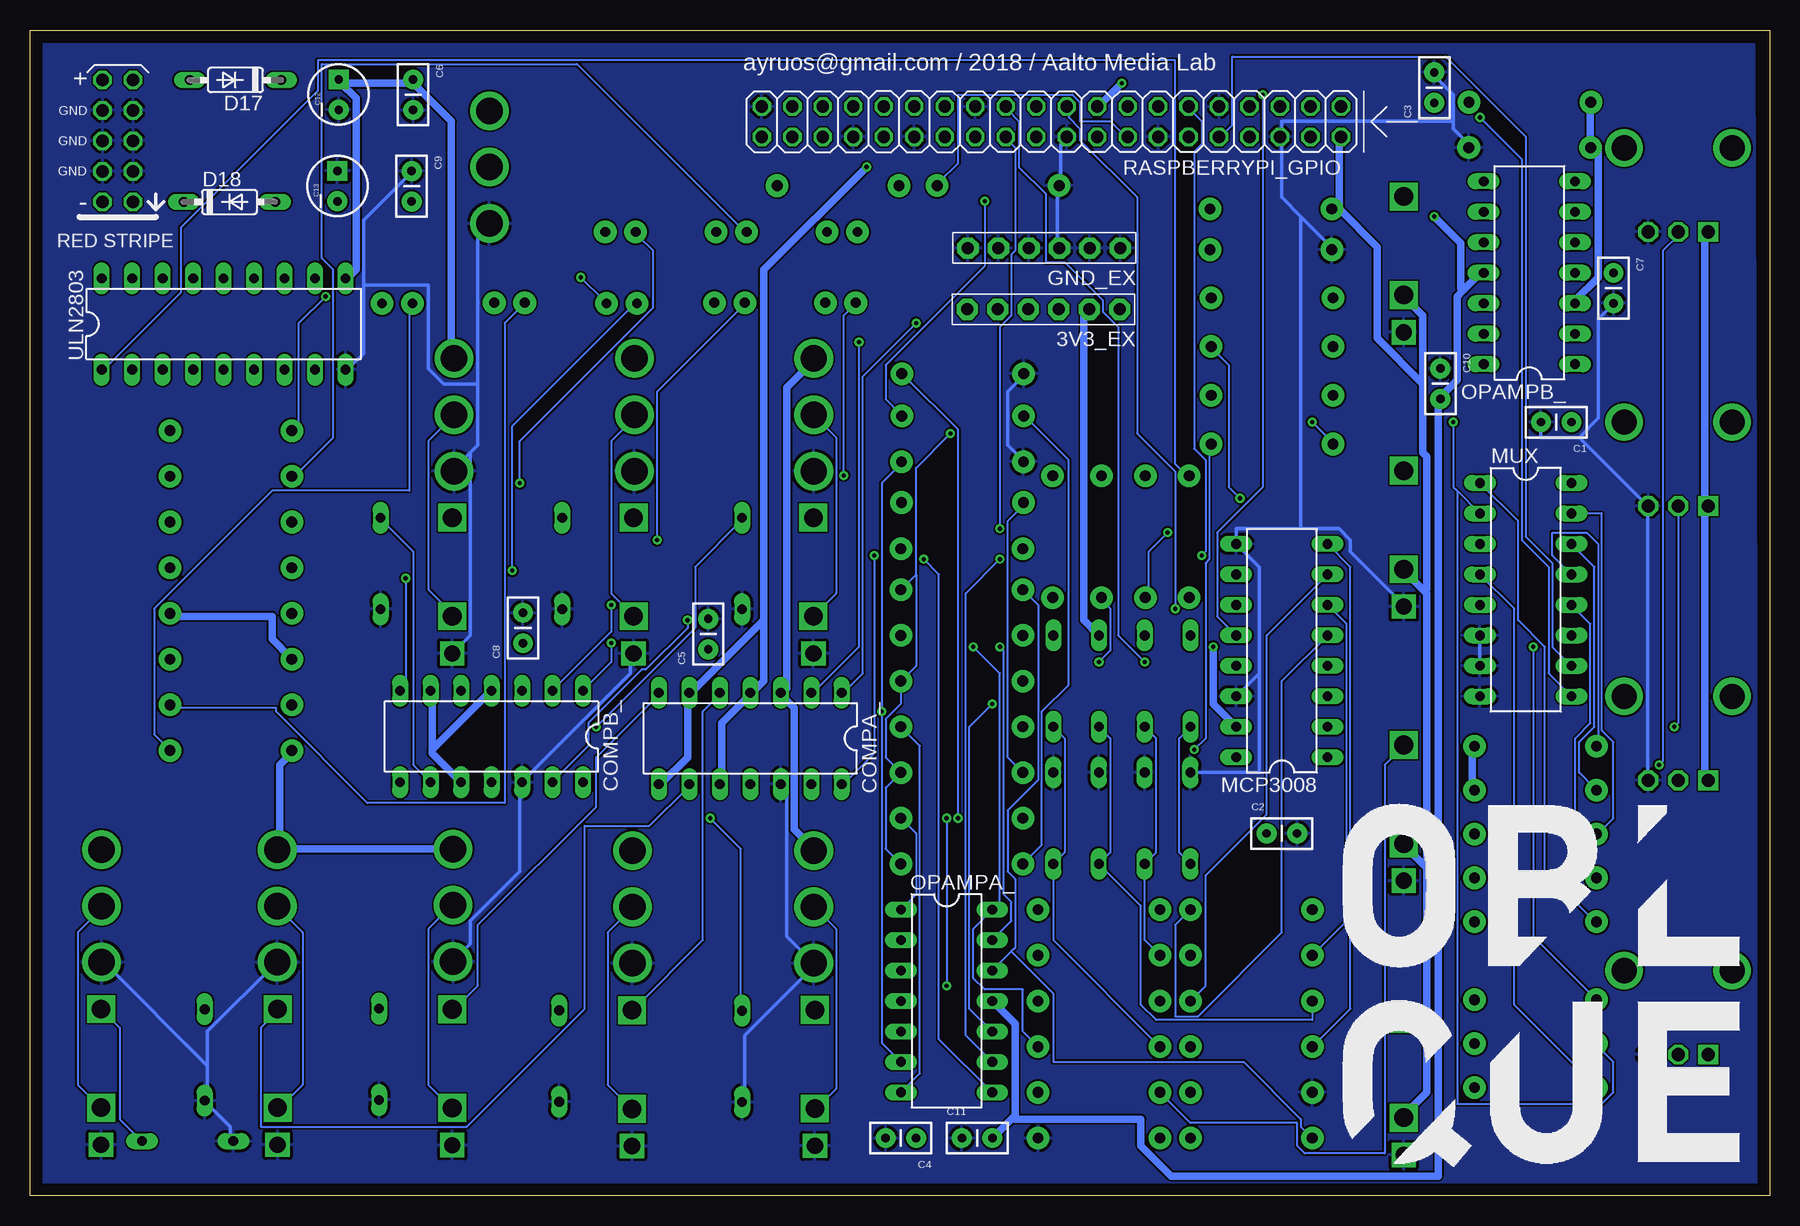
[diagram p5: board, bottom side, seen from below]

Size 144.96 x 97.21 mm. Coordinates in mm from the lower left corner, seen from the top.
Outline: 0,0 144.96,0 144.96,97.21 0,97.21 0,0
Copper layers (1*16): Top 0.035mm / dielectric 1.5mm / Bottom 0.035mm
Design rules "SeeedStudio_2layer_DRU_no_angle_20140221": minimum track width 6mil, minimum drill 0.35mm, track to track 6mil, track to pad 6mil, pad to pad 6mil, via to via 6mil, smd to smd 6mil, copper to edge 40mil, drill to drill 6mil, minimum pad ring 10mil, minimum via ring 8mil, stop-mask expansion 4mil, vias tented up to drill 0mil, thermal gap 10mil

### Footprints (pad centres in the part's own frame; a part is rotated, then mirrored left to right if it is on the bottom)
1X06-BIG = drill 1.016 pad 1.778 octagon: 1 -6.35,0; 2 -3.81,0; 3 -1.27,0; 4 1.27,0; 5 3.81,0; 6 6.35,0
CAP-PTH-SMALL2 = drill 0.7 pad 1.651: 1 0,0; 2 2.54,0
CPOL-RADIAL-10UF-25V = drill 0.7 pad 1.651 square: 1 1.27,0 | drill 0.7 pad 1.651: 2 -1.27,0
DIL14 = drill 0.813 long: 1 -7.62,-3.81; 2 -5.08,-3.81; 3 -2.54,-3.81; 4 0,-3.81; 5 2.54,-3.81; 6 5.08,-3.81; 7 7.62,-3.81; 8 7.62,3.81; 9 5.08,3.81; 10 2.54,3.81; 11 0,3.81; 12 -2.54,3.81; 13 -5.08,3.81; 14 -7.62,3.81
THONKICONN = drill 1.35 square: P$1_SLEEVE 0,-6.48 | drill 1.55 square: P$2_SWITCH 0,-3.38; P$3_TIP 0,4.84
DO35-7 = drill 0.813 long: A 3.81,0; C -3.81,0
LED3MM = drill 0.813 pad 1.88: A -1.27,0; K 1.27,0
DIL16 = drill 0.813 long: 1 -8.89,-3.81; 2 -6.35,-3.81; 3 -3.81,-3.81; 4 -1.27,-3.81; 5 1.27,-3.81; 6 3.81,-3.81; 7 6.35,-3.81; 8 8.89,-3.81; 9 8.89,3.81; 10 6.35,3.81; 11 3.81,3.81; 12 1.27,3.81; 13 -1.27,3.81; 14 -3.81,3.81; 15 -6.35,3.81; 16 -8.89,3.81
M9040P = drill 2.2: 1 0,4.699 | drill 2.2 pad 3: 2 0,0; 3 0,-4.699
9MM_SNAP-IN_POT = drill 1.1 square: 1 -2.5,-7 | drill 1.1 octagon: 2 0,-7; 3 2.5,-7 | drill 2.1 pad 2.794: CHASSIS1 -4.5,0; CHASSIS2 4.5,0
AXIAL-0.4 = drill 0.9 pad 1.88: P$1 -5.08,0; P$2 5.08,0
2X20 = drill 1.016 octagon: 1 -24.13,-1.27; 2 -24.13,1.27; 3 -21.59,-1.27; 4 -21.59,1.27; 5 -19.05,-1.27; 6 -19.05,1.27; 7 -16.51,-1.27; 8 -16.51,1.27; 9 -13.97,-1.27; 10 -13.97,1.27; 11 -11.43,-1.27; 12 -11.43,1.27; 13 -8.89,-1.27; 14 -8.89,1.27; 15 -6.35,-1.27; 16 -6.35,1.27; 17 -3.81,-1.27; 18 -3.81,1.27; 19 -1.27,-1.27; 20 -1.27,1.27; 21 1.27,-1.27; 22 1.27,1.27; 23 3.81,-1.27; 24 3.81,1.27; 25 6.35,-1.27; 26 6.35,1.27; 27 8.89,-1.27; 28 8.89,1.27; 29 11.43,-1.27; 30 11.43,1.27; 31 13.97,-1.27; 32 13.97,1.27; 33 16.51,-1.27; 34 16.51,1.27; 35 19.05,-1.27; 36 19.05,1.27; 37 21.59,-1.27; 38 21.59,1.27; 39 24.13,-1.27; 40 24.13,1.27
EURO_POWER_HEADER = drill 1.016 octagon: 1 -5.08,-1.27; 2 -5.08,1.27; 3 -2.54,-1.27; 4 -2.54,1.27; 5 0,-1.27; 6 0,1.27; 7 2.54,-1.27; 8 2.54,1.27; 9 5.08,-1.27; 10 5.08,1.27
DIL18 = drill 0.813 long: 1 -10.16,-3.81; 2 -7.62,-3.81; 3 -5.08,-3.81; 4 -2.54,-3.81; 5 0,-3.81; 6 2.54,-3.81; 7 5.08,-3.81; 8 7.62,-3.81; 9 10.16,-3.81; 10 10.16,3.81; 11 7.62,3.81; 12 5.08,3.81; 13 2.54,3.81; 14 0,3.81; 15 -2.54,3.81; 16 -5.08,3.81; 17 -7.62,3.81; 18 -10.16,3.81

### Placement (x,y rotation side)
3V3_EX  60.5,73.93 180 bottom
C1  16.51,64.52 180 bottom
C2  41.91,30.23 0 bottom
C3  27.94,91.14 90 bottom
C4  71.12,4.83 180 bottom
C5  88.44,45.57 90 bottom
C6  113.03,93.07 270 bottom
C7  13,76.96 270 bottom
C8  103.89,46.08 90 bottom
C9  113.15,85.44 270 bottom
C10  27.43,68.99 270 bottom
C11  67.31,4.83 0 bottom
C12  119.24,91.82 90 bottom
C13  119.35,84.19 90 bottom
COMPA_  84.94,38.15 180 bottom
COMPB_  106.5,38.3 180 bottom
CVIN_0  30.48,78.49 0 top
CVIN_1  30.48,55.63 0 top
CVIN_2  30.48,32.77 0 top
CVIN_3  30.48,9.91 0 top
D1  48.26,42.93 270 top
D2  48.26,31.5 90 top
D3  52.07,42.93 270 top
D4  52.07,31.5 90 top
D5  55.88,42.93 270 top
D6  55.88,31.5 90 top
D7  59.69,42.93 270 top
D8  59.69,31.5 90 top
D9  85.62,52.73 270 top
D10  100.61,52.73 270 top
D11  115.75,52.73 270 top
D12  85.62,11.63 270 top
D13  100.86,11.66 270 top
D14  115.87,11.81 270 top
D15  130.4,11.76 270 top
D16  131.83,4.57 180 top
D17  127.84,93.03 180 bottom
D18  128.34,82.88 0 bottom
GND_EX  60.46,79.02 180 bottom
LED1  77.27,80.37 0 top
LED2  86.51,80.37 0 top
LED3  95.76,80.37 0 top
LED4  77.42,74.47 0 top
LED5  86.66,74.47 0 top
LED6  95.66,74.42 0 top
LED7  105,74.47 0 top
LED8  114.35,74.42 0 top
MCP3008  40.64,45.47 90 bottom
MUX  20.32,50.55 270 bottom
OPAMPA_  68.58,16.26 270 bottom
OPAMPB_  20.02,76.96 90 bottom
PIDOWN  106.68,85.77 0 top
POT1  7.62,87.38 0 top
POT2  7.62,64.52 0 top
POT3  7.62,41.66 0 top
POT4  7.62,18.8 0 top
R1  19.97,91.19 180 top
R2  19.99,87.4 0 top
R3  55.88,23.88 0 top
R4  43.18,23.88 0 top
R5  55.88,20.07 180 top
R6  43.18,20.07 180 top
R7  55.88,16.26 0 top
R8  43.18,16.26 0 top
R9  55.88,12.45 180 top
R10  43.18,12.45 180 top
R11  41.55,82.3 0 top
R12  41.55,78.89 180 top
R13  67.23,68.55 0 top
R14  67.23,65.02 180 top
R15  67.31,27.69 180 top
R16  67.31,31.5 0 top
R17  67.31,39.12 0 top
R18  67.26,61.21 0 top
R19  67.26,57.81 180 top
R20  67.31,35.31 180 top
R21  67.31,53.95 0 top
R22  67.31,42.93 180 top
R23  55.88,8.64 0 top
R24  55.88,4.83 180 top
R25  67.31,46.74 0 top
R26  67.31,50.55 180 top
R27  43.18,8.64 0 top
R28  43.18,4.83 180 top
R29  19.51,37.49 0 top
R30  19.51,33.83 0 top
R31  19.51,30.18 0 top
R32  19.51,26.52 0 top
R33  19.51,22.86 0 top
R34  19.51,16.36 0 top
R35  19.51,12.7 0 top
R36  19.51,9.04 0 top
R37  128.22,63.8 180 top
R38  128.22,59.99 180 top
R39  128.22,56.18 180 top
R40  128.22,52.37 180 top
R41  128.22,48.56 180 top
R42  128.22,44.75 180 top
R43  128.22,40.94 180 top
R44  128.22,37.13 180 top
R45  48.36,54.97 90 top
R46  52.02,54.97 90 top
R47  55.68,54.97 90 top
R48  59.74,54.97 90 top
R49  41.45,70.82 180 top
R50  41.45,74.88 180 top
R51  41.45,66.75 180 top
R52  41.45,62.69 180 top
R61  77.62,84.23 0 top
R62  64.28,84.24 180 top
RASPBERRYPI_GPIO  59.84,89.56 180 bottom
SV1  137.64,87.96 90 bottom
TRIG0  79.68,51.71 0 top
TRIG1  94.67,51.71 0 top
TRIG2  109.78,51.71 0 top
TRIG3  79.55,10.67 0 top
TRIG4  94.79,10.64 0 top
TRIG5  109.78,10.72 0 top
TRIG6  124.33,10.74 0 top
TRIG7  139.04,10.74 0 top
TRIGS0  79.65,65.13 0 top
TRIGS1  94.59,65.13 0 top
TRIGS2  109.63,65.13 0 top
TRIGS3  79.65,24.1 0 top
TRIGS4  94.77,24.1 0 top
TRIGS5  109.7,24.23 0 top
TRIGS6  124.36,24.18 0 top
TRIGS7  138.99,24.18 0 top
ULN2803  128.83,72.69 0 bottom

### Tracks (layer width: path | path; a pad name or v marks a point on that pad's centre or on a via)
3V3  (via drill 0.35)
  Top 0.61: PIDOWN.1 106.68,90.55 104.46,92.77 v53.98,92.77 37.78,92.77 35.88,90.87 RASPBERRYPI_GPIO.1 35.56,90.87 27.94,90.87 C3.1 27.94,91.19 25.08,91.19 R1.P$1 24.77,91.5 23.5,92.77 11.43,92.77 5.4,86.74 5.4,80.39 POT1.1 | POT3.1 5.4,34.35 5.4,11.81 POT4.1 5.4,11.49 6.67,10.22 13.34,10.22 13.65,10.54 24.77,10.54 | C1.1 MUX.16 7.3,59.44 5.4,57.53 POT2.1 | D7.C D5.C D3.C D1.C 47.31,45.78 v46.35,45.78 | 3V3_EX.6 66.67,74.04 64.45,74.04 3V3_EX.5 64.14,74.04 61.91,74.04 3V3_EX.4 61.59,74.04 59.37,74.04 3V3_EX.3 59.05,74.04 56.83,74.04 3V3_EX.2 56.52,74.04 54.29,74.04 3V3_EX.1 | MCP3008.15 MCP3008.16 41.91,36.58 41.91,33.4 | 41.91,33.4 C2.1 | 24.77,10.54 24.77,12.45 R35.P$2 24.77,12.76 24.77,16.26 R34.P$2 24.77,16.57 24.77,22.61 R33.P$2 24.77,22.92 24.77,26.42 R32.P$2 24.77,26.73 24.77,29.91 R31.P$2 24.77,30.23 24.77,33.4 | 24.77,10.54 24.77,9.27 R36.P$2 | 24.77,33.4 24.77,33.72 R30.P$2 24.77,33.4 | 24.77,33.4 41.91,33.4
  Bottom 0.61: v53.98,92.77 55.88,90.87 RASPBERRYPI_GPIO.17 | POT1.1 5.4,80.07 5.4,57.53 POT2.1 5.4,57.21 5.4,34.67 POT3.1 | D5.C 57.15,48.01 57.15,73.41 56.83,73.72 3V3_EX.2 | R30.P$2 24.77,34.04 24.77,37.21 R29.P$2 | v46.35,45.78 46.35,41.02 MCP3008.15
5V_PI
  Top 0.61: RASPBERRYPI_GPIO.2 35.88,88.33 38.1,88.33 RASPBERRYPI_GPIO.4
  Bottom 0.61: RASPBERRYPI_GPIO.2 35.88,88.01 35.88,82.61 36.2,82.3 R11.P$1 35.88,82.3 32.7,79.12 32.7,71.5 28.89,67.69 | 28.73,27.53 30.48,29.27 CVIN_2.P$2_SWITCH | 28.73,27.53 28.57,27.37 28.57,8.64 30.48,6.73 CVIN_3.P$2_SWITCH | 28.73,50.39 28.57,50.23 28.57,27.69 28.73,27.53 | 28.73,50.39 30.48,52.13 CVIN_1.P$2_SWITCH | 28.89,67.69 28.89,61.98 28.57,61.66 28.57,50.55 28.73,50.39 | 28.89,67.69 28.89,73.41 30.48,74.99 CVIN_0.P$2_SWITCH
+12V
  Top 0.61: 104.14,44.2 104.14,45.78 C8.1 | 104.14,44.2 104.14,42.29 COMPB_.3 | COMPA_.3 82.55,41.97 86.04,45.47 88.27,45.47 C5.1 88.58,45.47 91.44,45.47 93.34,43.56 95.89,43.56 96.52,44.2 104.14,44.2 | C4.1 74.3,8 74.3,16.26 OPAMPA_.4 77.47,21.34 77.47,28.64 79.38,28.64 TRIGS3.1 79.69,28.96 94.61,28.96 TRIGS4.1 94.93,28.96 109.54,28.96 TRIGS5.1 | R41.P$1 133.35,48.64 133.35,52.13 R40.P$1 133.35,52.45 133.35,55.94 R39.P$1 133.35,56.26 133.35,59.75 R38.P$1 133.35,60.07 133.35,63.56 R37.P$1 | R44.P$2 123.19,37.21 123.19,40.7 R43.P$2 123.19,41.02 123.19,44.51 R42.P$2 | TRIGS7.1 138.75,28.96 124.46,28.96 TRIGS6.1 | D17.C 123.83,93.09 119.38,93.09 C12.1 | C7.1 13.02,76.9 16.19,76.9 OPAMPB_.4 16.51,76.9 22.86,70.55 29.21,70.55 30.48,69.28 60.64,69.28 61.59,70.23 79.06,70.23 79.38,69.91 TRIGS0.1 79.69,69.91 94.3,69.91 TRIGS1.1 94.61,69.91 109.54,69.91 TRIGS2.1
  Bottom 0.61: TRIGS3.1 79.69,28.96 81.28,30.54 81.28,40.7 82.23,41.66 COMPA_.3 82.23,41.97 81.92,42.29 81.92,67.37 79.69,69.6 TRIGS0.1 | R44.P$2 123.19,36.89 124.14,35.94 124.14,28.96 TRIGS6.1 123.83,28.96 109.86,28.96 TRIGS5.1 | R41.P$1 133.03,48.32 124.78,48.32 124.78,46.42 123.19,44.83 R42.P$2 | ULN2803.10 118.43,76.58 117.79,77.22 117.79,91.5 119.06,92.77 C12.1 118.75,92.77 113.03,92.77 | 113.03,92.77 109.86,89.6 109.86,69.91 TRIGS2.1 | 113.03,92.77 C6.1
-12V  (via drill 0.35)
  Top 0.61: D18.A 124.46,82.93 119.38,82.93 C13.2 119.06,82.93 113.35,82.93 C9.2 113.03,82.93 112.71,83.25 83.82,83.25 83.19,82.61 66.36,82.61 65.72,81.98 49.21,81.98 47.31,83.88 34.29,83.88 32.07,81.66 v27.94,81.66
  Bottom 0.61: OPAMPA_.11 62.87,14.35 62.87,6.73 63.02,6.57 | C11.2 63.02,6.57 | 25.56,75.47 26.04,74.99 26.04,68.01 27.3,66.74 C10.2 27.62,66.42 27.62,1.65 49.85,1.65 52.39,4.19 52.39,6.41 62.87,6.41 63.02,6.57 | 25.56,75.47 24.13,76.9 OPAMPB_.11 | v27.94,81.66 25.72,79.44 25.72,75.63 25.56,75.47
ADC_0  (via drill 0.35)
  Top 0.152: MCP3008.1 36.2,35.94 v9.21,35.94
  Bottom 0.152: v9.21,35.94 8.89,36.26 8.89,78.8 7.62,80.07 POT1.2
ADC_1  (via drill 0.35)
  Top 0.152: v7.94,39.12 MCP3008.2
  Bottom 0.152: v7.94,39.12 7.62,39.43 POT2.2
ADC_2
  Top 0.152: MCP3008.3 34.92,39.75 7.62,39.75 7.3,39.43 7.3,34.67 7.62,34.67 POT3.2
ADC_3
  Top 0.152: MCP3008.4 35.88,45.15 12.38,45.15 6.35,39.12 6.35,11.81 7.62,11.81 POT4.2
ADC_4
  Bottom 0.152: MCP3008.5 40.64,42.93 40.64,21.97 47.62,14.99 49.53,14.99 49.53,22.61 R4.P$2
ADC_5
  Bottom 0.152: MCP3008.6 35.24,47.69 35.24,22.92 R6.P$2
ADC_6
  Bottom 0.152: MCP3008.7 41.91,46.74 41.91,31.81 46.99,26.73 46.99,17.53 R8.P$2
ADC_7
  Bottom 0.152: MCP3008.8 34.92,52.45 34.92,15.62 R10.P$2
AIN_0
  Top 0.152: R3.P$1 52.07,25.15 71.12,25.15 OPAMPA_.1
  Bottom 0.152: OPAMPA_.1 71.12,25.15 71.12,30.23 R16.P$2
AIN_1
  Top 0.152: OPAMPA_.7 66.36,14.67 66.36,20.07 R5.P$1
  Bottom 0.152: R17.P$2 70.8,37.53 70.8,10.22 OPAMPA_.7
AIN_2  (via drill 0.35)
  Top 0.152: OPAMPA_.8 66.36,10.22 66.36,12.45 62.87,12.45 59.05,16.26 R7.P$1 | v70.48,53.09 71.75,53.09 72.39,53.72 R21.P$2
  Bottom 0.152: v70.48,53.09 69.22,51.82 69.22,13.08 OPAMPA_.8
AIN_3  (via drill 0.35)
  Top 0.152: R25.P$2 71.44,45.78 v66.36,45.78
  Bottom 0.152: R9.P$1 62.23,13.72 62.23,17.21 65.41,17.21 66.36,18.16 66.36,22.29 OPAMPA_.14 64.14,24.51 64.14,43.56 v66.36,45.78
BUFF1V65  (via drill 0.35)
  Top 0.152: OPAMPB_.2 16.19,71.82 16.19,69.6 OPAMPB_.1 16.51,69.28 21.91,63.88 61.59,63.88 61.91,63.56 v68.26,63.56
  Bottom 0.152: R15.P$1 73.66,28.96 73.66,34.04 R20.P$1 73.66,36.58 73.66,39.75 72.39,41.02 R22.P$1 71.12,44.2 71.12,51.82 | v68.26,63.56 71.12,60.71 71.12,51.82 | R26.P$1 71.12,51.82
BUFF2V5  (via drill 0.35)
  Top 0.61: COMPB_.10 111.12,36.58 112.08,36.58 113.98,34.67 COMPB_.8 | OPAMPB_.6 16.19,82.3 16.19,84.52 OPAMPB_.7 16.51,84.84 17.46,85.79 v75.25,85.79 | COMPB_.4 104.46,40.07 91.76,40.07 90.17,41.66 COMPA_.6
  Bottom 0.61: COMPB_.10 111.44,36.89 111.44,37.21 | 111.44,37.21 111.44,41.97 COMPB_.6 | 111.44,37.21 106.68,41.97 COMPB_.4 | COMPA_.8 92.39,34.35 90.17,36.58 90.17,41.66 COMPA_.6 89.85,41.97 83.82,48.01 | COMPA_.10 87.31,34.35 87.31,39.43 85.09,41.66 COMPA_.4 84.77,41.97 83.82,42.93 83.82,48.01 | v75.25,85.79 83.82,77.22 83.82,48.01
GND
  Top 0.305: 35.88,6.41 33.02,3.56 30.48,3.56 CVIN_3.P$1_SLEEVE | 35.88,6.41 R27.P$1 43.18,3.56 59.69,3.56 R24.P$1 62.23,6.1 66.04,6.1 C11.1 68.58,3.56 72.39,3.56 C4.2 74.3,4.19 79.38,4.19 TRIG3.P$1_SLEEVE 79.69,4.19 81.92,4.19 85.41,7.68 D12.A 85.72,7.68 89.22,4.19 94.61,4.19 TRIG4.P$1_SLEEVE 94.93,4.19 97.16,4.19 100.65,7.68 D13.A | 48.9,35.31 D4.A D6.A D8.A | MUX.7 24.13,42.93 | 24.13,42.93 MUX.8 | 24.13,42.93 43.18,42.93 MCP3008.14 | 48.9,35.31 42.55,28.96 40.64,28.96 C2.2 38.1,28.96 33.02,28.96 30.48,26.42 CVIN_2.P$1_SLEEVE 30.48,26.1 28.89,26.1 28.89,13.4 35.88,6.41 | 48.9,35.31 D2.A | RASPBERRYPI_GPIO.39 83.82,90.55 82.87,89.6 77.79,89.6 76.52,88.33 RASPBERRYPI_GPIO.34 76.2,88.01 75.25,87.06 72.39,87.06 71.44,88.01 RASPBERRYPI_GPIO.30 71.12,88.33 69.85,89.6 67.31,89.6 66.36,90.55 RASPBERRYPI_GPIO.25 66.04,90.55 65.09,89.6 60.01,89.6 58.74,88.33 RASPBERRYPI_GPIO.20 58.42,88.01 57.47,87.06 49.85,87.06 | GND_EX.6 66.67,79.12 64.45,79.12 GND_EX.5 64.14,79.12 61.91,79.12 GND_EX.4 61.59,79.12 59.37,79.12 GND_EX.3 59.05,79.12 56.83,79.12 GND_EX.2 56.52,79.12 54.29,79.12 GND_EX.1 | 49.85,87.06 41.91,87.06 40.96,88.01 RASPBERRYPI_GPIO.6 | 49.85,87.06 50.8,88.01 RASPBERRYPI_GPIO.14 50.8,88.33 49.53,89.6 46.99,89.6 46.04,90.55 RASPBERRYPI_GPIO.9 | CVIN_0.P$1_SLEEVE 30.48,72.14 36.2,77.85 36.2,78.8 R12.P$2 | POT4.3 10.16,11.81 10.16,34.35 POT3.3 | 26.99,68.64 26.67,68.33 21.91,68.33 16.83,73.41 13.97,73.41 13.02,74.36 C7.2 12.7,74.68 10.16,74.68 10.16,80.07 POT1.3 9.84,80.39 15.88,86.42 23.81,86.42 24.77,87.38 R2.P$2 | 26.99,68.64 27.3,68.96 C10.1 26.99,68.64
  Top 0.305: 26.99,68.64 61.91,68.64 R13.P$1 | D16.A 127.95,4.51 124.46,4.51 TRIG6.P$1_SLEEVE 124.14,4.51 120.65,8 D14.A 115.57,8 112.08,4.51 109.86,4.51 TRIG5.P$1_SLEEVE 109.54,4.51 104.14,4.51 100.97,7.68 D13.A | TRIG7.P$1_SLEEVE 138.75,4.51 135.57,7.68 130.49,7.68 D15.A | 101.92,19.43 109.54,19.43 TRIGS5.3 | 101.92,19.43 94.93,19.43 TRIGS4.3 | 101.92,19.43 101.92,8 100.97,8 D13.A | D11.A 115.57,48.64 112.39,45.47 109.86,45.47 TRIG2.P$1_SLEEVE 109.54,45.47 107,45.47 104.14,48.32 C8.2 103.82,48.64 100.65,48.64 D10.A 96.84,45.15 94.93,45.15 TRIG1.P$1_SLEEVE 94.61,45.47 93.98,46.1 90.49,46.1 88.58,48.01 C5.2 88.27,48.32 86.04,48.32 85.72,48.64 D9.A 85.41,48.64 82.87,48.64 79.69,45.47 TRIG0.P$1_SLEEVE | SV1.7 136.53,90.55 138.75,90.55 SV1.8 | 136.53,85.47 136.53,87.69 SV1.5 136.53,88.01 136.53,90.23 SV1.7 | SV1.6 139.06,87.69 139.06,85.47 SV1.4 138.75,85.47 136.53,85.47 | 136.53,85.47 SV1.3 | C6.2 113.03,85.47 C9.1 113.35,85.47 119.06,85.47 C13.1 119.38,85.47 119.38,90.23 C12.2 119.38,90.55 136.21,90.55 SV1.7 | TRIGS0.3 79.69,60.39 94.3,60.39 TRIGS1.3 94.61,60.39 109.54,60.39 TRIGS2.3
  Bottom 0.305: MUX.7 MUX.6 | 42.55,43.56 MCP3008.14 | 42.55,43.56 42.55,52.45 MCP3008.9 44.45,55.63 39.05,55.63 | 39.05,55.63 35.88,55.63 34.92,54.67 34.92,53.72 30.48,49.28 CVIN_1.P$1_SLEEVE | D2.A 42.55,35.31 42.55,43.56 | RASPBERRYPI_GPIO.20 58.74,88.01 59.05,87.69 59.05,84.52 R62.P$2 59.37,84.2 59.37,79.12 GND_EX.3 | 26.35,89.6 26.35,88.96 25.08,87.69 R2.P$2 | 26.35,89.6 26.35,91.82 27.94,93.41 C3.2 | 39.05,81.66 40.64,83.25 40.64,88.01 RASPBERRYPI_GPIO.6 40.64,88.33 40.64,89.6 26.35,89.6 | 39.05,81.66 36.51,79.12 R12.P$2 | 15.88,63.25 10.16,57.53 POT2.3 10.16,57.21 10.16,34.67 POT3.3 | 15.88,63.25 19.05,63.25 C1.2 | R18.P$1 62.23,61.34 63.5,62.61 63.5,67.06 62.23,68.33 R13.P$1 | 15.88,63.25 14.29,64.83 14.29,73.09 13.02,74.36 C7.2 | 39.05,81.66 39.05,55.63 | COMPA_.12 82.23,34.04 81.92,33.72 81.92,21.65 79.69,19.43 TRIGS3.3 79.69,19.11 85.41,13.4 85.41,8 D12.A | D16.A 128.27,4.83 128.27,5.78 130.18,7.68 D15.A 130.18,8 130.18,10.86 | 130.18,10.86 130.18,13.72 124.46,19.43 TRIGS6.3 | 130.18,10.86 138.75,19.43 TRIGS7.3 | TRIG1.P$1_SLEEVE 94.93,45.15 94.93,43.56 103.82,34.67 COMPB_.12 104.14,34.35 104.14,27.05 108.27,22.92 108.27,21.02 109.54,19.75 TRIGS5.3 | 117.16,75.95 117.16,81.34 113.35,85.15 C9.1 | 117.16,75.95 117.16,70.23 118.43,68.96 ULN2803.9 | 107.63,67.69 107.63,62.61 108.27,61.98 | 107.63,67.69 107.63,80.07 106.68,81.03 PIDOWN.3 | 108.27,61.98 109.54,60.71 TRIGS2.3 | 117.16,75.95 111.76,75.95 111.76,68.96 110.49,67.69 107.63,67.69 | 108.27,61.98 108.27,46.74 109.54,45.47 TRIG2.P$1_SLEEVE
  pour Top (isolate 0): 1.22,96.01 143.87,96.01 144.17,95.71 144.17,1.22 144.48,0.91 0.91,0.91
  pour Bottom (isolate 0): 1.22,96.01 144.17,96.01 144.17,1.22 144.48,0.91 0.91,0.91
GPIO8  (via drill 0.35)
  Top 0.152: MCP3008.10 45.4,52.77 59.37,52.77 62.23,55.63 v64.14,55.63
  Bottom 0.152: v64.14,55.63 64.14,72.45 63.18,73.41 63.18,78.49 62.87,78.8 62.87,87.38 63.5,88.01 RASPBERRYPI_GPIO.24
GPIO9  (via drill 0.35)
  Top 0.152: v42.23,91.82 60.01,91.82 60.96,90.87 RASPBERRYPI_GPIO.21
  Bottom 0.152: MCP3008.12 46.04,48.32 46.04,55.31 42.23,59.12 v42.23,91.82
GPIO10  (via drill 0.35)
  Top 0.152: MCP3008.11 45.09,48.64 49.21,48.64 v49.53,48.96
  Bottom 0.152: v49.53,48.96 49.53,60.39 52.7,63.56 52.7,83.25 57.47,88.01 57.47,88.96 58.42,89.92 58.42,90.55 RASPBERRYPI_GPIO.19
GPIO11  (via drill 0.35)
  Top 0.152: MCP3008.13 44.77,44.51 v52.07,44.51
  Bottom 0.152: v52.07,44.51 54.29,46.74 54.29,72.45 55.56,73.72 55.56,74.68 58.74,77.85 60.33,77.85 60.33,83.57 62.55,85.79 62.55,89.6 63.5,90.55 RASPBERRYPI_GPIO.23
GPIO14
  Top 0.152: MUX.11 15.24,48.01 12.38,48.01 1.27,59.12 1.27,79.12 7.94,79.12 8.89,80.07 8.89,89.28 42.23,89.28 43.18,88.33 RASPBERRYPI_GPIO.8
GPIO15
  Bottom 0.152: MUX.10 18.1,45.78 18.1,52.77 20.32,54.99 20.32,88.33 26.99,95 44.77,95 44.77,89.28 45.72,88.33 RASPBERRYPI_GPIO.10
GPIO17  (via drill 0.35)
  Top 0.152: MUX.3 24.77,53.72 35.24,53.72 35.56,53.4 v47.31,53.4
  Bottom 0.152: v47.31,53.4 46.99,53.72 46.99,61.34 47.94,62.29 47.94,87.06 47.31,87.69 47.31,89.6 48.26,90.55 RASPBERRYPI_GPIO.11
GPIO18  (via drill 0.35)
  Top 0.152: v24.13,89.92 24.45,89.6 46.35,89.6 47.62,88.33 48.26,88.33 RASPBERRYPI_GPIO.12
  Bottom 0.152: MUX.9 18.41,43.56 18.41,52.45 20.64,54.67 20.64,86.42 v24.13,89.92
GPIO23
  Top 0.152: R61.P$1 72.39,84.2 69.53,84.2 R62.P$1
  Bottom 0.152: RASPBERRYPI_GPIO.16 53.66,88.33 54.93,89.6 57.47,89.6 57.47,91.19 58.1,91.82 67.63,91.82 67.63,86.11 69.22,84.52 R62.P$1
MUX_0  (via drill 0.35)
  Top 0.152: v96.52,49.28 93.34,52.45 53.66,52.45 52.39,51.18 49.85,51.18 49.21,50.55 | 49.21,50.55 48.58,49.91 R45.P$1 | MUX.13 17.78,50.55 49.21,50.55
  Bottom 0.152: v96.52,49.28 96.52,47.05 101.28,42.29 COMPB_.2 | MUX.13 18.1,53.4 18.1,55.31 15.24,55.31 14.29,54.36 14.29,37.53 R29.P$1
MUX_1  (via drill 0.35)
  Top 0.152: v96.52,46.1 95.89,46.74 92.39,46.74 87,52.13 54.29,52.13 52.07,49.91 R46.P$1 | MUX.14 17.46,55.31 v50.16,55.31
  Bottom 0.152: MUX.14 14.61,52.45 14.61,39.12 15.88,37.85 15.88,35.31 14.61,34.04 R30.P$1 | v96.52,46.1 96.52,44.51 98.74,42.29 COMPB_.1 | v50.16,55.31 51.75,53.72 51.75,49.91 R46.P$1
MUX_2  (via drill 0.35)
  Top 0.152: COMPB_.14 98.74,34.67 93.98,39.43 77.79,39.43 72.71,44.51 v55.88,44.51 52.07,40.7 43.81,40.7 38.73,35.62 20,35.62 14.61,30.23 R31.P$1
  Bottom 0.152: MUX.15 13.97,56.9 13.97,38.8 13.02,37.85 13.02,31.5 14.29,30.23 R31.P$1 | v55.88,44.51 54.93,45.47 54.93,48.96 55.56,49.59 R47.P$1
MUX_3  (via drill 0.35)
  Top 0.152: v90.17,48.01 86.36,51.82 61.59,51.82 59.69,49.91 R48.P$1 59.69,49.59 58.42,48.32 47.62,48.32 46.99,47.69 23.5,47.69 22.54,48.64 17.14,48.64 MUX.12
  Bottom 0.152: MUX.12 14.92,47.69 14.92,39.43 16.19,38.16 16.19,28.32 14.61,26.73 R32.P$1 | v90.17,48.01 90.17,47.37 93.66,43.88 93.98,43.88 98.42,39.43 98.42,37.53 101.28,34.67 COMPB_.13
MUX_4  (via drill 0.35)
  Top 0.152: v75.88,71.18 75.56,70.87 46.67,70.87 R49.P$1 | MUX.1 25.4,58.17 v44.13,58.17
  Bottom 0.152: MUX.1 20.95,56.26 20.95,48.01 18.73,45.78 18.73,27.05 14.61,22.92 R33.P$1 | v75.88,71.18 75.88,45.78 79.69,41.97 COMPA_.2 | v44.13,58.17 45.09,59.12 45.09,69.28 46.35,70.55 R49.P$1
MUX_5  (via drill 0.35)
  Top 0.152: MUX.5 23.18,50.23 14.92,50.23 14.92,48.64 15.24,48.32 17.14,48.32 v19.68,45.78 35.88,45.78 36.51,45.15 73.98,45.15 77.15,41.97 COMPA_.1 | v71.12,72.77 48.58,72.77 46.67,74.68 R50.P$1
  Bottom 0.152: v19.68,45.78 19.68,21.65 14.61,16.57 R34.P$1 | v71.12,72.77 75.56,68.33 75.56,43.56 77.15,41.97 COMPA_.1
MUX_6  (via drill 0.35)
  Top 0.152: v26.35,64.52 26.99,65.15 44.77,65.15 46.35,66.74 R51.P$1 | v74.61,53.4 71.75,56.26 24.77,56.26 MUX.2
  Bottom 0.152: 26.04,58.8 26.35,59.12 v26.35,64.52 | 26.04,58.8 MUX.2 | v74.61,53.4 74.61,36.89 77.15,34.35 COMPA_.14 | 26.04,58.8 26.04,7.68 13.97,7.68 13.02,8.64 13.02,11.18 14.29,12.45 R35.P$1
MUX_7  (via drill 0.35)
  Top 0.152: v47.94,37.21 76.83,37.21 79.69,34.35 COMPA_.13 | MUX.4 22.54,53.4 15.24,53.4 14.92,53.72 14.92,58.48 20.95,58.48 24.45,61.98 35.24,61.98 35.88,61.34 45.09,61.34 46.35,62.61 R52.P$1
  Bottom 0.152: MUX.4 21.27,48.96 21.27,15.94 14.61,9.27 R36.P$1 | v47.94,37.21 46.99,38.16 46.99,52.77 46.67,53.09 46.67,62.61 R52.P$1
N$1
  Top 0.152: 45.4,24.83 44.45,23.88 R4.P$1 | 45.4,24.83 D2.C | R3.P$2 59.69,22.61 47.62,22.61 45.4,24.83
  Bottom 0.152: D1.A 49.21,38.16 49.21,28.64 D2.C
N$2
  Top 0.152: R5.P$2 R6.P$1
  Bottom 0.152: R5.P$2 52.07,21.34 D4.C 51.12,28.64 51.12,38.16 D3.A
N$3
  Top 0.152: R8.P$1 39.37,17.53 59.69,17.53 R7.P$2
  Bottom 0.152: D5.A 54.93,38.16 54.93,28.64 D6.C 52.39,24.19 52.39,15.94 51.12,14.67 38.1,14.67 R8.P$1
N$4
  Top 0.152: R9.P$2 R10.P$1
  Bottom 0.152: D7.A 58.74,38.16 58.74,28.64 D8.C 59.69,21.34 R9.P$2
N$5  (via drill 0.35)
  Top 0.152: OPAMPA_.2 71.44,22.29 37.78,22.29 36.83,23.24 36.83,28.32 46.67,28.32 49.85,31.5 R16.P$1 v67.63,31.5
  Bottom 0.152: v67.63,31.5 67.63,63.88 72.07,68.33 R13.P$2
N$6  (via drill 0.35)
  Top 0.152: v65.41,82.93 49.21,82.93 47.62,84.52 31.43,84.52 30.48,83.57 CVIN_0.P$3_TIP
  Bottom 0.152: v65.41,82.93 65.41,77.53 73.66,69.28 73.66,66.42 72.39,65.15 R14.P$1
N$7  (via drill 0.35)
  Top 0.152: R17.P$1 63.5,40.39 v73.98,40.39
  Bottom 0.152: OPAMPA_.6 73.98,12.76 v73.98,40.39 73.98,59.44 72.39,61.02 R18.P$2
N$8
  Top 0.152: OPAMPA_.3 73.98,20.38 73.98,26.42 63.5,26.42 R15.P$2
  Bottom 0.152: R15.P$2 60.64,29.27 60.64,40.39 58.42,42.61 58.42,61.34 61.91,64.83 R14.P$2
N$9  (via drill 0.35)
  Top 0.152: OPAMPA_.9 63.5,9.91 55.88,9.91 R24.P$2 | v64.14,53.09 62.87,53.09 62.23,53.72 R21.P$1
  Bottom 0.152: v64.14,53.09 66.99,50.23 66.99,13.4 OPAMPA_.9
N$10  (via drill 0.35)
  Top 0.152: v68.58,17.53 OPAMPA_.5 | v68.58,31.5 64.77,35.31 R20.P$2
  Bottom 0.152: v68.58,31.5 v68.58,17.53 | R20.P$2 63.5,36.58 63.5,56.26 62.23,57.53 R19.P$2
N$11  (via drill 0.35)
  Top 0.152: OPAMPA_.10 65.72,12.76 66.67,12.76 66.67,7.68 61.91,7.68 R23.P$2 | R22.P$2 64.14,41.02 v64.77,41.02
  Bottom 0.152: v64.77,41.02 66.67,39.12 66.67,15.62 OPAMPA_.10
N$12
  Top 0.152: R19.P$1 72.07,57.85 70.8,59.12 61.28,59.12 60.64,58.48 44.77,58.48 42.86,60.39 30.48,60.39 CVIN_1.P$3_TIP
N$13  (via drill 0.35)
  Top 0.152: OPAMPA_.13 41.27,21.34 36.83,16.89 36.83,14.99 41.91,14.99 R27.P$2 | R25.P$1 63.18,45.78 v64.14,45.78
  Bottom 0.152: v64.14,45.78 63.82,45.47 63.82,25.15 63.18,24.51 63.18,22.92 OPAMPA_.13
N$14
  Bottom 0.152: R23.P$1 48.26,6.1 39.37,6.1 39.37,4.19 38.73,3.56 32.07,3.56 32.07,35.94 30.48,37.53 CVIN_2.P$3_TIP
N$15
  Top 0.152: R28.P$1 38.42,14.67 30.48,14.67 CVIN_3.P$3_TIP
N$16
  Bottom 0.152: 63.18,20.38 62.87,20.7 62.87,26.42 63.5,27.05 63.5,32.13 60.96,34.67 60.96,49.28 R26.P$2 | 63.18,20.38 OPAMPA_.12 | R28.P$2 39.05,5.78 39.05,6.41 43.81,11.18 59.69,11.18 59.69,16.89 63.18,20.38
N$17
  Bottom 0.152: TRIG0.P$2_SWITCH 79.38,48.64 77.79,50.23 77.79,63.25 79.38,64.83 TRIGS0.2
N$18
  Bottom 0.152: TRIG1.P$2_SWITCH 94.93,48.64 96.52,50.23 96.52,62.93 94.61,64.83 TRIGS1.2
N$19
  Bottom 0.152: TRIG2.P$2_SWITCH 109.86,48.64 111.76,50.55 111.76,62.93 109.86,64.83 TRIGS2.2
N$20
  Bottom 0.152: TRIG3.P$2_SWITCH 79.38,7.37 77.79,8.95 77.79,22.29 79.38,23.88 TRIGS3.2
N$21  (via drill 0.35)
  Top 0.152: v120.33,74.99 120.02,74.68 118.43,74.68 117.16,75.95 80.33,75.95 76.2,80.07 LED1.A
  Bottom 0.152: v120.33,74.99 122.56,72.77 122.56,64.2 122.87,63.88 R37.P$2
N$22
  Bottom 0.152: LED2.A 85.41,80.39 99.38,94.36 120.65,94.36 120.65,78.17 119.7,77.22 119.7,63.25 122.87,60.07 R38.P$2
N$23  (via drill 0.35)
  Top 0.152: v104.14,59.44 105.41,58.17 120.97,58.17 122.87,56.26 R39.P$2
  Bottom 0.152: v104.14,59.44 104.14,62.93 93.03,74.04 93.03,78.8 94.3,80.07 LED3.A
N$24  (via drill 0.35)
  Top 0.152: v77.15,60.07 79.06,58.17 104.46,58.17 110.17,52.45 122.87,52.45 R40.P$2
  Bottom 0.152: v77.15,60.07 77.15,73.41 76.2,74.36 LED4.A
N$25
  Bottom 0.152: TRIG4.P$2_SWITCH 94.93,7.37 96.84,9.27 96.84,21.97 94.93,23.88 TRIGS4.2
N$26
  Bottom 0.152: TRIG5.P$2_SWITCH 109.86,7.37 111.76,9.27 111.76,22.29 109.86,24.19 TRIGS5.2
N$27
  Bottom 0.152: TRIG6.P$2_SWITCH 124.14,7.37 122.24,9.27 122.24,21.97 124.14,23.88 TRIGS6.2
N$28
  Bottom 0.152: TRIG7.P$2_SWITCH 139.06,7.37 140.97,9.27 140.97,21.97 139.06,23.88 TRIGS7.2
N$29  (via drill 0.35)
  Top 0.152: v92.71,54.67 96.84,50.55 120.97,50.55 122.87,48.64 R41.P$2
  Bottom 0.152: v92.71,54.67 92.71,67.06 85.41,74.36 LED5.A
N$30  (via drill 0.35)
  Top 0.152: v104.78,52.13 106.05,50.86 127,50.86 133.03,44.83 R42.P$1
  Bottom 0.152: v104.78,52.13 104.78,64.2 94.61,74.36 LED6.A
N$31
  Bottom 0.152: R43.P$1 133.03,40.7 124.46,40.7 124.46,40.39 116.84,32.77 105.41,32.77 105.41,72.77 103.82,74.36 LED7.A
N$32
  Bottom 0.152: R44.P$1 133.35,37.21 134.62,38.48 134.62,48.96 124.78,58.8 113.35,58.8 113.35,74.36 LED8.A
N$33
  Top 0.152: ULN2803.16 133.67,76.58 131.76,78.49 109.54,78.49 109.22,78.17 99.06,78.17 97.16,80.07 LED3.K
N$41
  Bottom 0.152: ULN2803.1 138.75,68.96 132.4,75.31 132.4,80.71 120.97,92.14 120.97,94.68 49.53,94.68 49.53,61.02 48.58,60.07 R45.P$2
N$42
  Top 0.152: ULN2803.18 138.75,76.58 136.21,79.12 100.65,79.12 97.79,81.98 80.33,81.98 78.74,80.39 LED1.K
N$43
  Top 0.152: ULN2803.17 136.21,76.58 133.99,78.8 100.33,78.8 97.47,81.66 89.22,81.66 87.95,80.39 LED2.K
N$45
  Top 0.152: ULN2803.15 127.32,72.45 80.64,72.45 78.74,74.36 LED4.K
N$46
  Top 0.152: ULN2803.14 125.09,72.77 89.53,72.77 87.95,74.36 LED5.K
N$47  (via drill 0.35)
  Top 0.152: v99.06,76.58 108.27,76.58 109.86,78.17 124.46,78.17 126.05,76.58 ULN2803.13
  Bottom 0.152: v99.06,76.58 97.16,74.68 LED6.K
N$48
  Top 0.152: ULN2803.12 120.33,73.09 107.63,73.09 106.36,74.36 LED7.K
N$49
  Top 0.152: ULN2803.11 120.97,76.26 120.97,74.36 115.89,74.36 LED8.K
N$50  (via drill 0.35)
  Top 0.152: D9.C 85.41,56.58 79.69,56.58 TRIG0.P$3_TIP | COMPB_.5 106.05,39.12 v97.79,39.12
  Bottom 0.152: v97.79,39.12 89.53,47.37 89.53,52.45 85.72,56.26 D9.C
N$51  (via drill 0.35)
  Top 0.152: ULN2803.8 119.38,67.06 48.58,67.06 46.04,64.52 v38.1,64.52
  Bottom 0.152: v38.1,64.52 36.51,62.93 R52.P$2
N$52
  Top 0.152: ULN2803.2 136.21,68.96 134.62,70.55 130.81,70.55 129.86,69.6 129.86,65.47 112.71,65.47 110.17,62.93 54.93,62.93 52.07,60.07 R46.P$2
N$53  (via drill 0.35)
  Top 0.152: TRIG1.P$3_TIP 94.93,56.58 100.33,56.58 D10.C 100.65,56.26 101.6,56.26 105.73,52.13 113.03,52.13 v113.67,51.5
  Bottom 0.152: v113.67,51.5 113.67,42.61 113.98,42.29 COMPB_.7
N$54
  Top 0.152: TRIG2.P$3_TIP 109.86,56.58 115.57,56.58 D11.C
  Bottom 0.152: COMPB_.9 113.03,35.94 113.03,53.72 115.57,56.26 D11.C
N$55
  Top 0.152: ULN2803.3 133.67,68.64 133.67,65.15 131.76,65.15 128.91,62.29 75.25,62.29 72.39,59.44 60.96,59.44 60.33,58.8 56.83,58.8 55.88,59.75 R47.P$2
N$56  (via drill 0.35)
  Top 0.152: D12.C 85.41,15.62 79.69,15.62 TRIG3.P$3_TIP | COMPB_.11 103.5,31.5 v88.27,31.5
  Bottom 0.152: v88.27,31.5 85.72,28.96 85.72,15.62 D12.C
N$57
  Top 0.152: D13.C 100.65,15.62 94.93,15.62 TRIG4.P$3_TIP
  Bottom 0.152: COMPA_.5 87.63,41.66 88.9,40.39 88.9,21.34 94.61,15.62 TRIG4.P$3_TIP
N$58
  Top 0.152: ULN2803.4 131.13,68.64 131.13,65.15 113.03,65.15 110.49,62.61 65.41,62.61 62.55,59.75 60.01,59.75 R48.P$2
N$59
  Top 0.152: D14.C 109.86,15.62 TRIG5.P$3_TIP
  Bottom 0.152: COMPA_.7 92.71,41.66 97.79,36.58 97.79,32.45 107.63,22.61 107.63,17.53 109.54,15.62 TRIG5.P$3_TIP
N$60
  Top 0.152: D15.C 130.18,15.62 124.46,15.62 TRIG6.P$3_TIP
  Bottom 0.152: COMPA_.9 90.17,34.04 93.34,30.86 98.74,30.86 98.74,15.62 108.58,5.78 125.73,5.78 125.73,14.03 124.46,15.3 TRIG6.P$3_TIP
N$61
  Top 0.152: ULN2803.5 127,67.06 126.05,67.06 124.78,68.33 124.78,71.82 47.31,71.82 46.99,72.14 37.78,72.14 36.51,70.87 R49.P$2
N$62
  Top 0.152: COMPA_.11 85.09,34.04 85.09,30.86 139.7,30.86 140.97,29.59 140.97,15.62 139.06,15.62 TRIG7.P$3_TIP
  Bottom 0.152: D16.C 137.48,6.41 137.48,14.03 138.75,15.3 TRIG7.P$3_TIP
N$63
  Top 0.152: R61.P$2 82.87,84.52 83.82,85.47 106.68,85.47 PIDOWN.2
N$64
  Top 0.152: ULN2803.6 126.05,68.96 126.05,72.14 47.62,72.14 46.35,73.41 37.78,73.41 36.51,74.68 R50.P$2
N$66
  Top 0.61: D17.A 131.76,93.09 136.21,93.09 SV1.9 136.53,93.09 138.75,93.09 SV1.10
N$67
  Top 0.152: ULN2803.7 123.51,68.96 121.92,70.55 113.03,70.55 109.86,67.37 47.62,67.37 46.99,68.01 37.47,68.01 36.51,67.06 R51.P$2
N$68
  Top 0.61: D18.C 132.4,82.93 136.21,82.93 SV1.1 136.53,82.93 138.75,82.93 SV1.2
REF1V65
  Bottom 0.61: OPAMPB_.3 16.19,74.68 14.29,76.58 14.29,87.06 14.61,87.38 R2.P$1 14.92,87.69 14.92,91.19 R1.P$2
REF2V5
  Top 0.61: 44.77,80.71 17.46,80.71 16.51,79.76 OPAMPB_.5 | 44.77,80.71 46.35,82.3 R11.P$2 | 44.77,80.71 46.35,79.12 R12.P$1

### Text on the board
tPlace: Hybrid Video Synth / v0.2 | THIS SIDE UP
bPlace: ayruos@gmail.com / 2018 / Aalto Media Lab